# EAGLE design Board_1v2 (EAGLE 9.3.0)
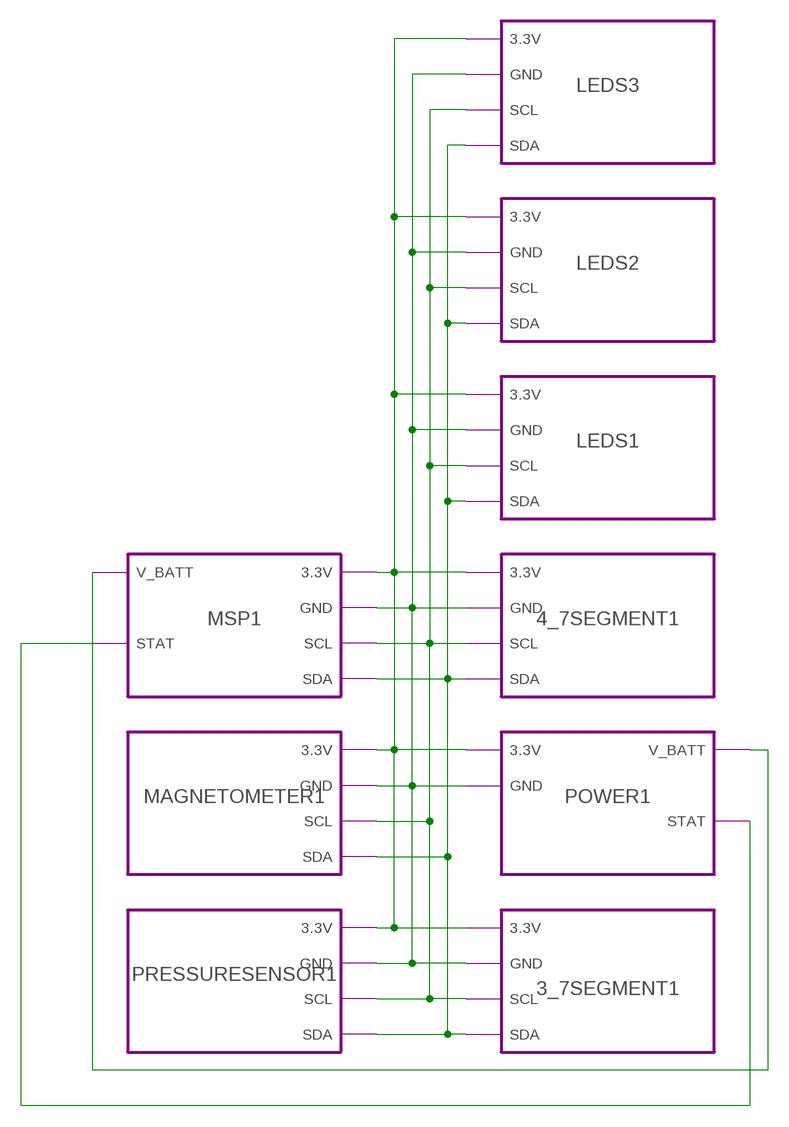
[diagram p0: schematic, sheet 1]

## Module instances
3_7SEGMENT1 = 3_7SEGMENT
4_7SEGMENT1 = 4_7SEGMENT
MAGNETOMETER1 = MAGNETOMETER
POWER1 = POWER
PRESSURESENSOR1 = PRESSURESENSOR
MSP1 = MSP
LEDS1 = LEDS
LEDS2 = LEDS
LEDS3 = LEDS

## Nets
3.3V: port MAGNETOMETER1.3.3V PRESSURESENSOR1.3.3V POWER1.3.3V MSP1.3.3V LEDS3.3.3V 3_7SEGMENT1.3.3V LEDS2.3.3V LEDS1.3.3V 4_7SEGMENT1.3.3V
GND: port MAGNETOMETER1.GND POWER1.GND PRESSURESENSOR1.GND 4_7SEGMENT1.GND 3_7SEGMENT1.GND MSP1.GND LEDS3.GND LEDS2.GND LEDS1.GND
N$1: port POWER1.V_BATT MSP1.V_BATT
N$2: port POWER1.STAT MSP1.STAT
SCL: port PRESSURESENSOR1.SCL 4_7SEGMENT1.SCL MAGNETOMETER1.SCL 3_7SEGMENT1.SCL MSP1.SCL LEDS3.SCL LEDS2.SCL LEDS1.SCL
SDA: port PRESSURESENSOR1.SDA 4_7SEGMENT1.SDA MAGNETOMETER1.SDA 3_7SEGMENT1.SDA MSP1.SDA LEDS3.SDA LEDS2.SDA LEDS1.SDA

## Library data of the parts

## Module MAGNETOMETER
Ports: 3.3V(io) GND(io) SCL(io) SDA(io)
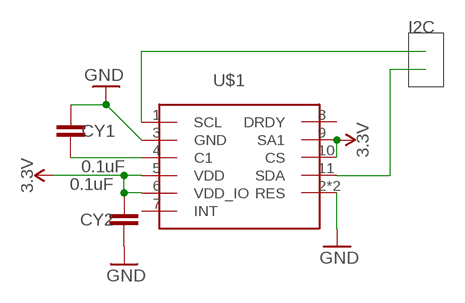
[diagram p1: schematic, module MAGNETOMETER, sheet 1]

### Parts
CY1  0.1uF  0.1UF-0603-25V-5%  [0603]
CY2  0.1uF  0.1UF-0603-25V-5%  [0603]
U$1  LIS3MDLTR  [LGA-12]

### Nets
3.3V: CY2.2 U$1.5(VDD) U$1.6(VDD_IO) U$1.9(SA1) U$1.10(CS)
GND: CY1.1 CY2.1 U$1.2(RES) U$1.3(GND) U$1.12(RES)
N$3: CY1.2 U$1.4(C1)
SCL: U$1.1(SCL)
SDA: U$1.11(SDA)
Unconnected: U$1.7(INT) U$1.8(DRDY)

### Notes on the sheet
- I2C

### Library data of the parts
CY1 CY2 = SparkFun-Capacitors:0.1UF: 0.1µF ceramic capacitors A capacitor is a passive two-terminal electrical component used to store electrical energy temporarily in an electric field.; PROD_ID: CAP-08604
U$1 = LED Driver:LIS3MDLTR

## Module POWER
Ports: GND(io) 3.3V(io) V_BATT(io) STAT(io)
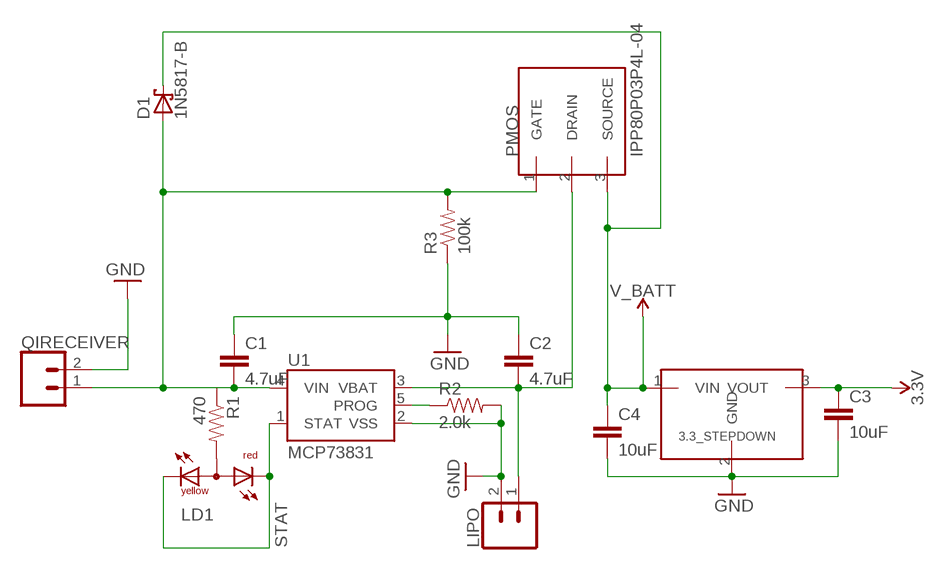
[diagram p2: schematic, module POWER, sheet 1]

### Parts
3.3_STEPDOWN  MCP1826S  [T03B]
C1  4.7uF  4.7UF0603  [0603]
C2  4.7uF  4.7UF0603  [0603]
C3  10uF  10UF-0603-6.3V-20%  [0603]
C4  10uF  10UF-0603-6.3V-20%  [0603]
D1  1N5817-B  [DO41-7.6]
LD1  DUOLED-RY-A  [DUOLED-A-5MM]
LIPO  CONN_02  [1X02]
PMOS  IPP80P03P4L-04  [T03B]
QIRECEIVER  CONN_02  [1X02]
R1  470  470OHM-0603-1/10W-1%  [0603]
R2  2.0k  2.0KOHM-0603-1/10W-5%  [0603]
R3  100k  100KOHM-0603-1/10W-1%  [0603]
U1  MCP73831  [SOT23-5]

### Nets
3.3V: 3.3_STEPDOWN.3(VOUT) C3.1
GND: 3.3_STEPDOWN.2(GND) C1.1 C2.1 C3.2 C4.2 LIPO.2 QIRECEIVER.2 R2.2 R3.1 U1.2(VSS)
N$2: C2.2 LIPO.1 PMOS.2(DRAIN) U1.3(VBAT)
N$4: C1.2 D1.A PMOS.1(GATE) QIRECEIVER.1 R1.1 R3.2 U1.4(VIN)
N$6: R2.1 U1.5(PROG)
N$7: LD1.A R1.2
STAT: LD1.CR LD1.CX(CY) U1.1(STAT)
V_BATT: 3.3_STEPDOWN.1(VIN) C4.1 D1.C PMOS.3(SOURCE)

### Library data of the parts
3.3_STEPDOWN = LED Driver:MCP1826S
C1 C2 = SparkFun-Capacitors:4.7UF: 4.7µF ceramic capacitors A capacitor is a passive two-terminal electrical component used to store electrical energy temporarily in an electric field.; PROD_ID: CAP-08280
C3 C4 = SparkFun-Capacitors:10UF: 10.0µF ceramic capacitors A capacitor is a passive two-terminal electrical component used to store electrical energy temporarily in an electric field.; PROD_ID: CAP-11015
D1 = diode:1N581*: 1.0A SCHOTTKY BARRIER RECTIFIER Source: http://www.diodes.com/datasheets/ds23001.pdf
LD1 = led:DUOLED-RY-A: DUO LED 2 colors (red/yellow), 5 mm, round, common Anode www.ligitek.com or other producers.
LIPO QIRECEIVER = SparkFun-Connectors:CONN_02: Multi connection point. Often used as Generic Header-pin footprint for 0.1 inch spaced/style header connections On any of the 0.1 inch spaced packages, you can populate with these: Break Away Headers - Straight <https://www.sparkfun.com/products/116> (PRT-00116) Break Away Male Headers - Right Angle <https://www.sparkfun.com/products/553> (PRT-00553) Female Headers <https://www.sparkfun.com/products/115> (PRT-00115) Break Away Headers - Machine Pin <https://www.sparkfun.com/products/117> (PRT-00117) Break Away Female Headers - Swiss Machine Pin <https://www.sparkfun.com/products/743> (PRT-00743) For SCREWTERMINALS and SPRING TERMINALS visit here: Screw Terimnals on SparkFun.com <https://www.sparkfun.com/search/results?term=Screw+Terminals> (5mm/3.5mm/2.54mm spacing) This device is also useful as a general connection point to wire up your design to another part of your project. Our various solder wires solder well into these plated through hole pads. Hook-Up Wire - Assortment (Stranded, 22 AWG) <https://www.sparkfun.com/products/11375> (PRT-11375) Hook-Up Wire - Assortment (Solid Core, 22 AWG) <https://www.sparkfun.com/products/11367> (PRT-11367) View the entire wire category on our website here <https://www.sparkfun.com/categories/141> Special notes: Molex polarized connector foot print use with: PRT-08233 with associated crimp pins and housings. 2.54_SCREWTERM for use with PRT-10571. 3.5mm Screw Terminal footprints for PRT-08084 5mm Screw Terminal footprints for use with PRT-08432
PMOS = LED Driver:IPP80P03P4L-04
R1 = SparkFun-Resistors:470OHM: 470Ω resistor A resistor is a passive two-terminal electrical component that implements electrical resistance as a circuit element. Resistors act to reduce current flow, and, at the same time, act to lower voltage levels within circuits. - Wikipedia; PROD_ID: RES-07869
R2 = SparkFun-Resistors:2.0KOHM: 2kΩ resistor A resistor is a passive two-terminal electrical component that implements electrical resistance as a circuit element. Resistors act to reduce current flow, and, at the same time, act to lower voltage levels within circuits. - Wikipedia; PROD_ID: RES-08296
R3 = SparkFun-Resistors:100KOHM: 100kΩ resistor A resistor is a passive two-terminal electrical component that implements electrical resistance as a circuit element. Resistors act to reduce current flow, and, at the same time, act to lower voltage levels within circuits. - Wikipedia; PROD_ID: RES-07828
U1 = SparkFun-IC-Power:MCP73831: MCP73831T Li-Ion, Li-Pol Controller Miniature single cell, fully integrated Li-Ion, Li-polymer charge management controller Datasheet <http://ww1.microchip.com/downloads/en/DeviceDoc/20001984g.pdf> SparkFun Products: SparkFun ESP32 Thing <https://www.sparkfun.com/products/13907> SparkFun 9DoF Razor IMU M0 <https://www.sparkfun.com/products/14001>; PROD_ID: IC-09995

## Module 4_7SEGMENT
Ports: GND(io) SCL(io) SDA(io) 3.3V(io)
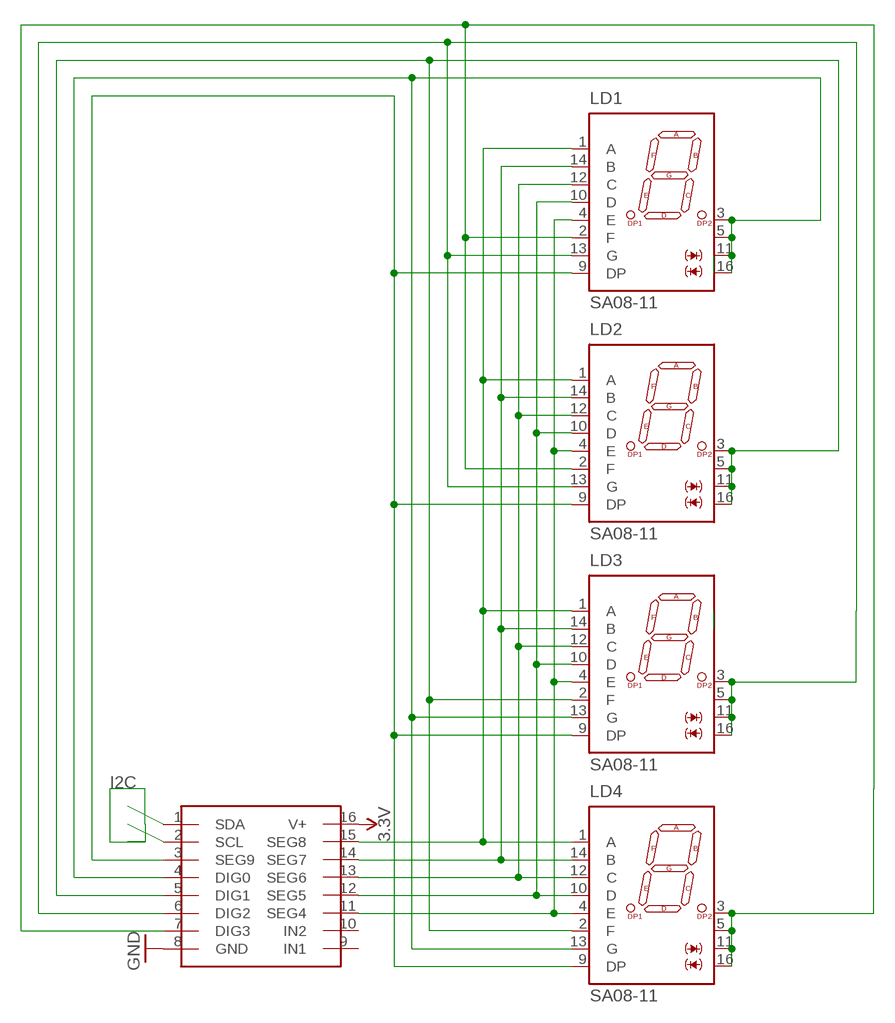
[diagram p3: schematic, module 4_7SEGMENT, sheet 1]

### Parts
LD1  SA08-11  [SA08]
LD2  SA08-11  [SA08]
LD3  SA08-11  [SA08]
LD4  SA08-11  [SA08]
LED_DRIVER_1  MAX6958BAPE+  [DIP16]

### Nets
3.3V: LED_DRIVER_1.16(V+)
GND: LED_DRIVER_1.8(GND)
N$1: LD1.1(A) LD2.1(A) LD3.1(A) LD4.1(A) LED_DRIVER_1.15(SEG8)
N$2: LD1.14(B) LD2.14(B) LD3.14(B) LD4.14(B) LED_DRIVER_1.14(SEG7)
N$3: LD1.12(C) LD2.12(C) LD3.12(C) LD4.12(C) LED_DRIVER_1.13(SEG6)
N$4: LD1.10(D) LD2.10(D) LD3.10(D) LD4.10(D) LED_DRIVER_1.12(SEG5)
N$5: LD1.4(E) LD2.4(E) LD3.4(E) LD4.4(E) LED_DRIVER_1.11(SEG4)
N$6: LD1.3(AK) LD1.5(AK) LD1.11(AK) LD1.16(AK) LD3.13(G) LD4.13(G) LED_DRIVER_1.4(DIG0)
N$7: LD1.9(DP) LD2.9(DP) LD3.9(DP) LD4.9(DP) LED_DRIVER_1.3(SEG9)
N$9: LD1.2(F) LD2.2(F) LD4.3(AK) LD4.5(AK) LD4.11(AK) LD4.16(AK) LED_DRIVER_1.7(DIG3)
N$12: LD2.3(AK) LD2.5(AK) LD2.11(AK) LD2.16(AK) LD3.2(F) LD4.2(F) LED_DRIVER_1.5(DIG1)
N$13: LD1.13(G) LD2.13(G) LD3.3(AK) LD3.5(AK) LD3.11(AK) LD3.16(AK) LED_DRIVER_1.6(DIG2)
SCL: LED_DRIVER_1.2(SCL)
SDA: LED_DRIVER_1.1(SDA)
Unconnected: LED_DRIVER_1.9(IN1) LED_DRIVER_1.10(IN2)

### Library data of the parts
LD1-LD4 = led:S*08: Kingbright 20mm (0.8Inch) Single Digit Numeric Display Source: SA08-11SRWA.pdf
LED_DRIVER_1 = UnderwaterSensorProject2:MAX6958BAPE+

## Module 3_7SEGMENT
Ports: GND(io) SCL(io) SDA(io) 3.3V(io)
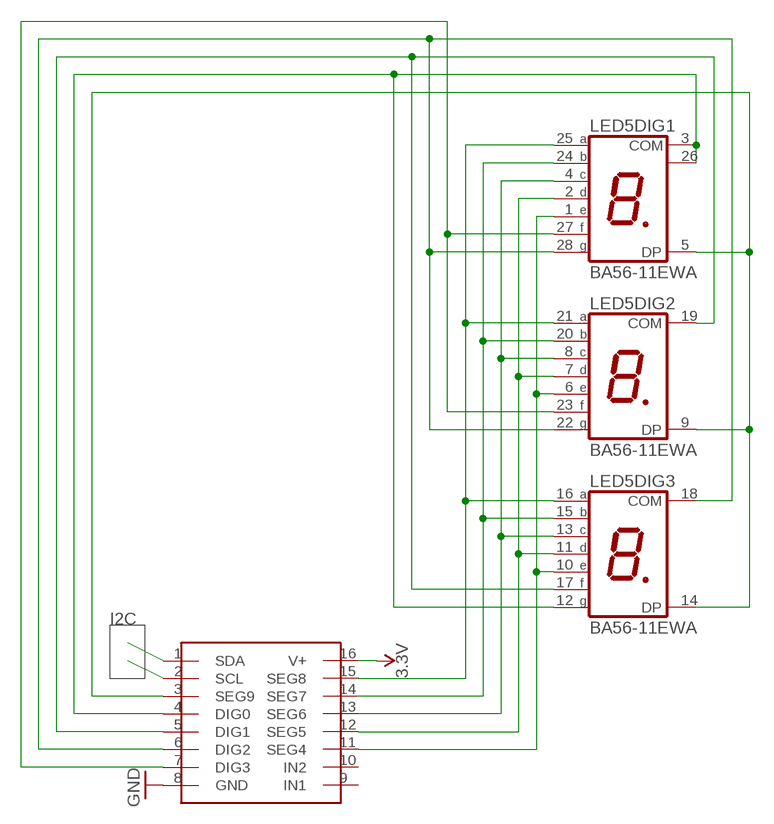
[diagram p4: schematic, module 3_7SEGMENT, sheet 1]

### Parts
LED5  BA56-11EWA  [BA/BC56]
U$1  MAX6958BAPE+  [DIP16]

### Nets
3.3V: U$1.16(V+)
GND: U$1.8(GND)
N$1: LED5.3(DIG1:COM) LED5.12(DIG3:G) LED5.26(DIG1:COM) U$1.4(DIG0)
N$2: LED5.5(DIG1:DP) LED5.9(DIG2:DP) LED5.14(DIG3:DP) U$1.3(SEG9)
N$8: LED5.16(DIG3:A) LED5.21(DIG2:A) LED5.25(DIG1:A) U$1.15(SEG8)
N$9: LED5.15(DIG3:B) LED5.20(DIG2:B) LED5.24(DIG1:B) U$1.14(SEG7)
N$10: LED5.4(DIG1:C) LED5.8(DIG2:C) LED5.13(DIG3:C) U$1.13(SEG6)
N$11: LED5.2(DIG1:D) LED5.7(DIG2:D) LED5.11(DIG3:D) U$1.12(SEG5)
N$26: LED5.1(DIG1:E) LED5.6(DIG2:E) LED5.10(DIG3:E) U$1.11(SEG4)
N$28: LED5.17(DIG3:F) LED5.19(DIG2:COM) U$1.5(DIG1)
N$29: LED5.23(DIG2:F) LED5.27(DIG1:F) U$1.7(DIG3)
N$30: LED5.18(DIG3:COM) LED5.22(DIG2:G) LED5.28(DIG1:G) U$1.6(DIG2)
SCL: U$1.2(SCL)
SDA: U$1.1(SDA)
Unconnected: U$1.9(IN1) U$1.10(IN2)

### Notes on the sheet
- I2C

### Library data of the parts
LED5 = display-kingbright:B?56-11*WA: 14.22mm (0.56INCH) THREE DIGIT NUMERIC DISPLAY Source: http://www.kingbright.com .. BA56-11EWA(Ver1189474895.pdf; OC_FARNELL: unknown; OC_NEWARK: unknown
U$1 = LED Driver:MAX6958BAPE+

## Module PRESSURESENSOR
Ports: 3.3V(io) GND(io) SCL(io) SDA(io)
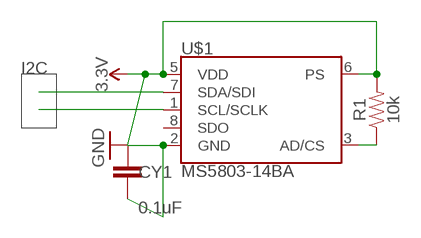
[diagram p5: schematic, module PRESSURESENSOR, sheet 1]

### Parts
CY1  0.1uF  0.1UF-0603-25V-5%  [0603]
R1  10k  10KOHM-0603-1/10W-1%  [0603]
U$1  MS5803-14BA  [DIL8]

### Nets
3.3V: CY1.1 R1.2 U$1.5(VDD) U$1.6(PS)
GND: CY1.2 U$1.2(GND)
N$1: R1.1 U$1.3(AD/CS)
SCL: U$1.1(SCL/SCLK)
SDA: U$1.7(SDA/SDI)
Unconnected: U$1.8(SDO)

### Notes on the sheet
- I2C

### Library data of the parts
CY1 = SparkFun-Capacitors:0.1UF: 0.1µF ceramic capacitors A capacitor is a passive two-terminal electrical component used to store electrical energy temporarily in an electric field.; PROD_ID: CAP-08604
R1 = SparkFun-Resistors:10KOHM: 10kΩ resistor A resistor is a passive two-terminal electrical component that implements electrical resistance as a circuit element. Resistors act to reduce current flow, and, at the same time, act to lower voltage levels within circuits. - Wikipedia; PROD_ID: RES-00824
U$1 = UnderwaterSensorProject:MS5803-14BA

## Module MSP
Ports: SDA(io) SCL(io) GND(io) 3.3V(io) V_BATT(io) STAT(io)
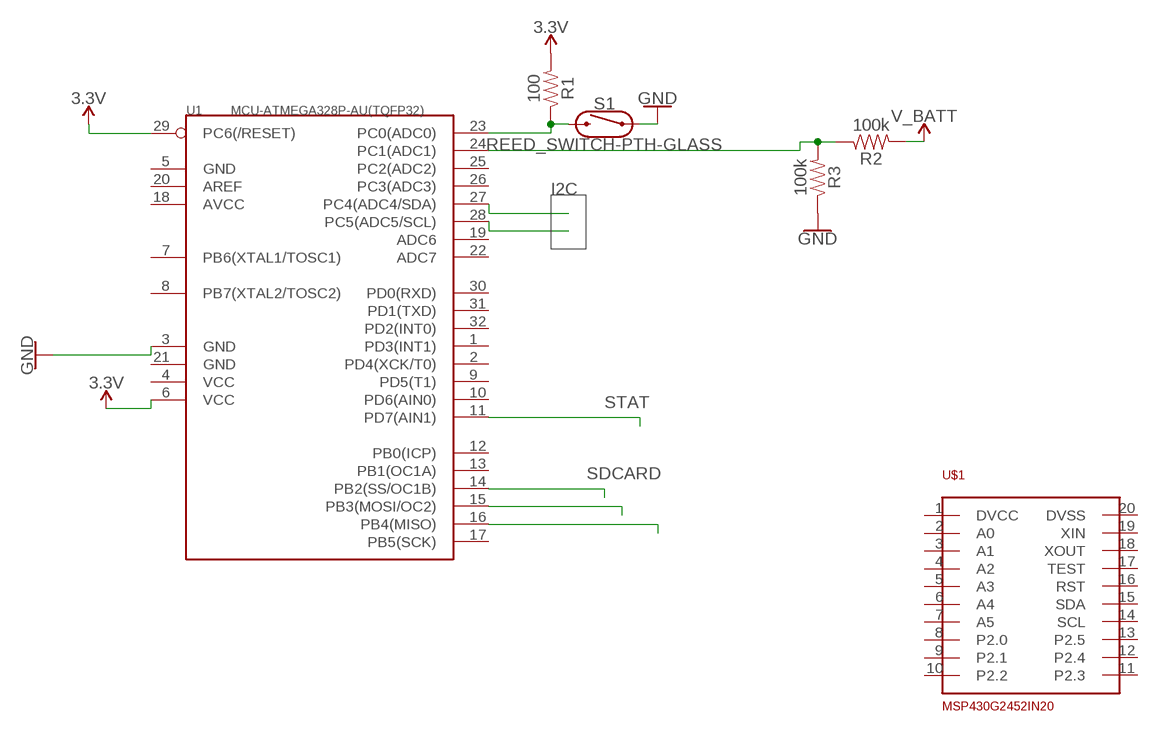
[diagram p6: schematic, module MSP, sheet 1]

### Parts
R1  100  100OHM-0603-1/4W-5%  [0603]
R2  100k  100KOHM-0603-1/10W-1%  [0603]
R3  100k  100KOHM-0603-1/10W-1%  [0603]
S1  REED_SWITCH-PTH-GLASS  [REED_SWITCH_GLASS]
U1  MCU-ATMEGA328P-AU(TQFP32)  [TQFP32-0.8-7X7MM]
U$1  MSP430G2452IN20  [DIL20]

### Nets
3.3V: R1.2 U1.6(VCC) U1.29(PC6(/RESET))
GND: R3.1 S1.P$1 U1.3(GND)
N$1: R1.1 S1.P$2 U1.23(PC0(ADC0))
N$2: R2.1 R3.2 U1.24(PC1(ADC1))
N$4: U1.15(PB3(MOSI/OC2))
N$5: U1.16(PB4(MISO))
SCL: U1.28(PC5(ADC5/SCL))
SDA: U1.27(PC4(ADC4/SDA))
SDCARD: U1.14(PB2(SS/OC1B))
STAT: U1.11(PD7(AIN1))
V_BATT: R2.2
Unconnected: U1.1(PD3(INT1)) U1.2(PD4(XCK/T0)) U1.4(VCC) U1.5(GND) U1.7(PB6(XTAL1/TOSC1)) U1.8(PB7(XTAL2/TOSC2)) U1.9(PD5(T1)) U1.10(PD6(AIN0)) U1.12(PB0(ICP)) U1.13(PB1(OC1A)) U1.17(PB5(SCK)) U1.18(AVCC) U1.19(ADC6) U1.20(AREF) U1.21(GND) U1.22(ADC7) U1.25(PC2(ADC2)) U1.26(PC3(ADC3)) U1.30(PD0(RXD)) U1.31(PD1(TXD)) U1.32(PD2(INT0)) U$1.1(DVCC) U$1.2(A0) U$1.3(A1) U$1.4(A2) U$1.5(A3) U$1.6(A4) U$1.7(A5) U$1.8(P2.0) U$1.9(P2.1) U$1.10(P2.2) U$1.11(P2.3) U$1.12(P2.4) U$1.13(P2.5) U$1.14(SCL) U$1.15(SDA) U$1.16(RST) U$1.17(TEST) U$1.18(XOUT) U$1.19(XIN) U$1.20(DVSS)

### Notes on the sheet
- I2C

### Library data of the parts
R1 = SparkFun-Resistors:100OHM: 100Ω resistor A resistor is a passive two-terminal electrical component that implements electrical resistance as a circuit element. Resistors act to reduce current flow, and, at the same time, act to lower voltage levels within circuits. - Wikipedia; PROD_ID: RES-12438
R2 R3 = SparkFun-Resistors:100KOHM: 100kΩ resistor A resistor is a passive two-terminal electrical component that implements electrical resistance as a circuit element. Resistors act to reduce current flow, and, at the same time, act to lower voltage levels within circuits. - Wikipedia; PROD_ID: RES-07828
S1 = SparkFun-Switches:REED_SWITCH: Reed Switch A reed switch is a magnetically-actuated switch. When the device is exposed to a magnetic field, the two ferrous materials inside the switch pull together and the switch closes. Variant Overview PTH-GLASS Reed Switch <https://www.sparkfun.com/products/8642> (COM-08642) - PTH reed switch w/ glass body (6.0 x 0.9 mm) PTH-INSULATED Reed Switch - Insulated <https://www.sparkfun.com/products/10601> (COM-10601) - PTH reed switch w/ insulated body (15.1 x 4.2 mm); PROD_ID: SWCH-09282; SF_SKU: COM-08642
U1 = MCU-ATMEGA328P-AU_TQFP32_:MCU-ATMEGA328P-AU(TQFP32): 310010049; AVAILABILITY: Unavailable; DESCRIPTION: Microcontroller Mcu, 8 Bit, Atmega, 20mhz, Tqfp-32; MF: Microchip; MP: ATMEGA328P-AU; PACKAGE: TQFP-32 Microchip; PRICE: None
U$1 = UnderwaterSensorProject:MSP430G2452IN20

## Module LEDS
Ports: SDA(io) SCL(io) GND(io) 3.3V(io)
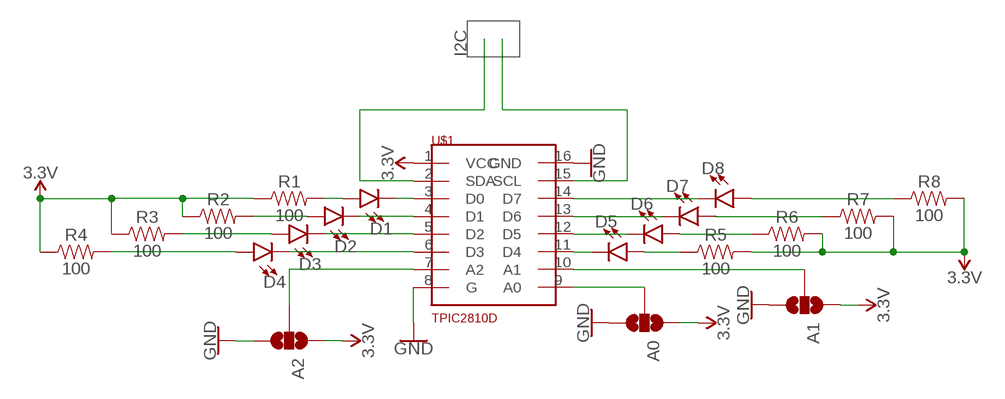
[diagram p7: schematic, module LEDS, sheet 1]

### Parts
A0  JUMPER-SMT_3_NO_SILK  [SMT-JUMPER_3_NO_SILK]
A1  JUMPER-SMT_3_NO_SILK  [SMT-JUMPER_3_NO_SILK]
A2  JUMPER-SMT_3_NO_SILK  [SMT-JUMPER_3_NO_SILK]
D1  LED5MM  [LED_5MM]
D2  LED5MM  [LED_5MM]
D3  LED5MM  [LED_5MM]
D4  LED5MM  [LED_5MM]
D5  LED5MM  [LED_5MM]
D6  LED5MM  [LED_5MM]
D7  LED5MM  [LED_5MM]
D8  LED5MM  [LED_5MM]
R1  100  100OHM-0603-1/4W-5%  [0603]
R2  100  100OHM-0603-1/4W-5%  [0603]
R3  100  100OHM-0603-1/4W-5%  [0603]
R4  100  100OHM-0603-1/4W-5%  [0603]
R5  100  100OHM-0603-1/4W-5%  [0603]
R6  100  100OHM-0603-1/4W-5%  [0603]
R7  100  100OHM-0603-1/4W-5%  [0603]
R8  100  100OHM-0603-1/4W-5%  [0603]
U$1  TPIC2810D  [SO16]

### Nets
3.3V: A0.1 A1.1 A2.1 R1.1 R2.1 R3.1 R4.1 R5.2 R6.2 R7.2 R8.2 U$1.1(VCC)
GND: A0.3 A1.3 A2.3 U$1.8(G) U$1.16(GND)
N$1: D1.K(C) U$1.3(D0)
N$2: D2.K(C) U$1.4(D1)
N$3: D3.K(C) U$1.5(D2)
N$4: D4.K(C) U$1.6(D3)
N$5: D5.K(C) U$1.11(D4)
N$6: D6.K(C) U$1.12(D5)
N$7: D7.K(C) U$1.13(D6)
N$8: D8.K(C) U$1.14(D7)
N$9: A2.2 U$1.7(A2)
N$10: A1.2 U$1.10(A1)
N$11: A0.2 U$1.9(A0)
N$12: D5.A R5.1
N$13: D6.A R6.1
N$14: D7.A R7.1
N$15: D8.A R8.1
N$16: D1.A R1.2
N$18: D2.A R2.2
N$19: D3.A R3.2
N$20: D4.A R4.2
SCL: U$1.15(SCL)
SDA: U$1.2(SDA)

### Notes on the sheet
- I2C

### Library data of the parts
A0 A1 A2 = SparkFun-Jumpers:JUMPER-SMT_3_NO: Normally open jumper This jumper has three pads in close proximity to each other. Apply solder to close the connection(s).
D1-D8 = SparkFun-LED:LED: LED (Generic) Standard schematic elements and footprints for 5mm, 3mm, 1206, and 0603 sized LEDs. Generic LEDs with no color specified.
R1-R8 = SparkFun-Resistors:100OHM: 100Ω resistor A resistor is a passive two-terminal electrical component that implements electrical resistance as a circuit element. Resistors act to reduce current flow, and, at the same time, act to lower voltage levels within circuits. - Wikipedia; PROD_ID: RES-12438
U$1 = UnderwaterSensorProject:TPIC2810D

## Board
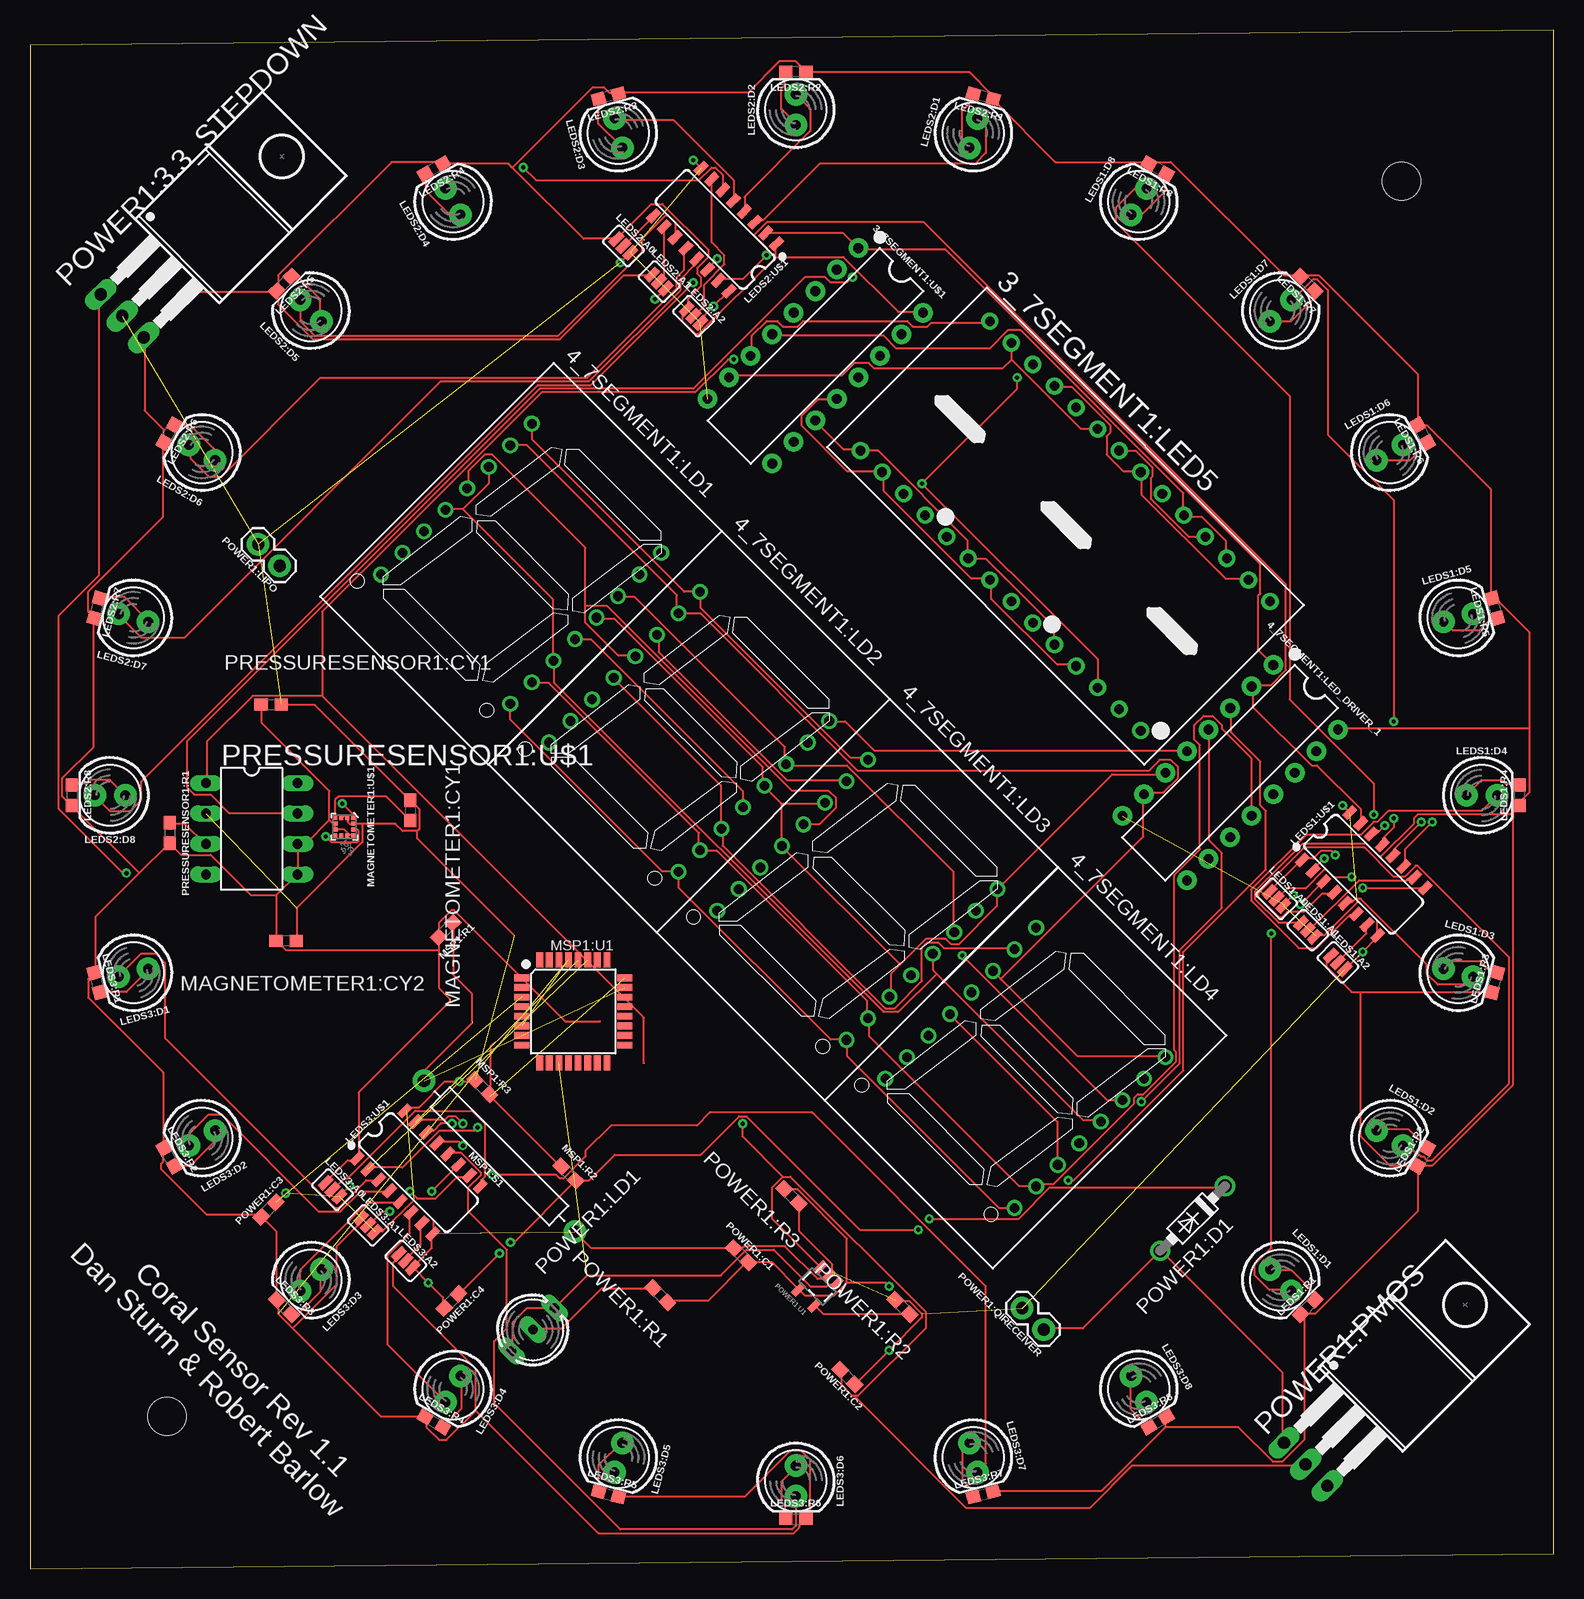
[diagram p8: board, top side]
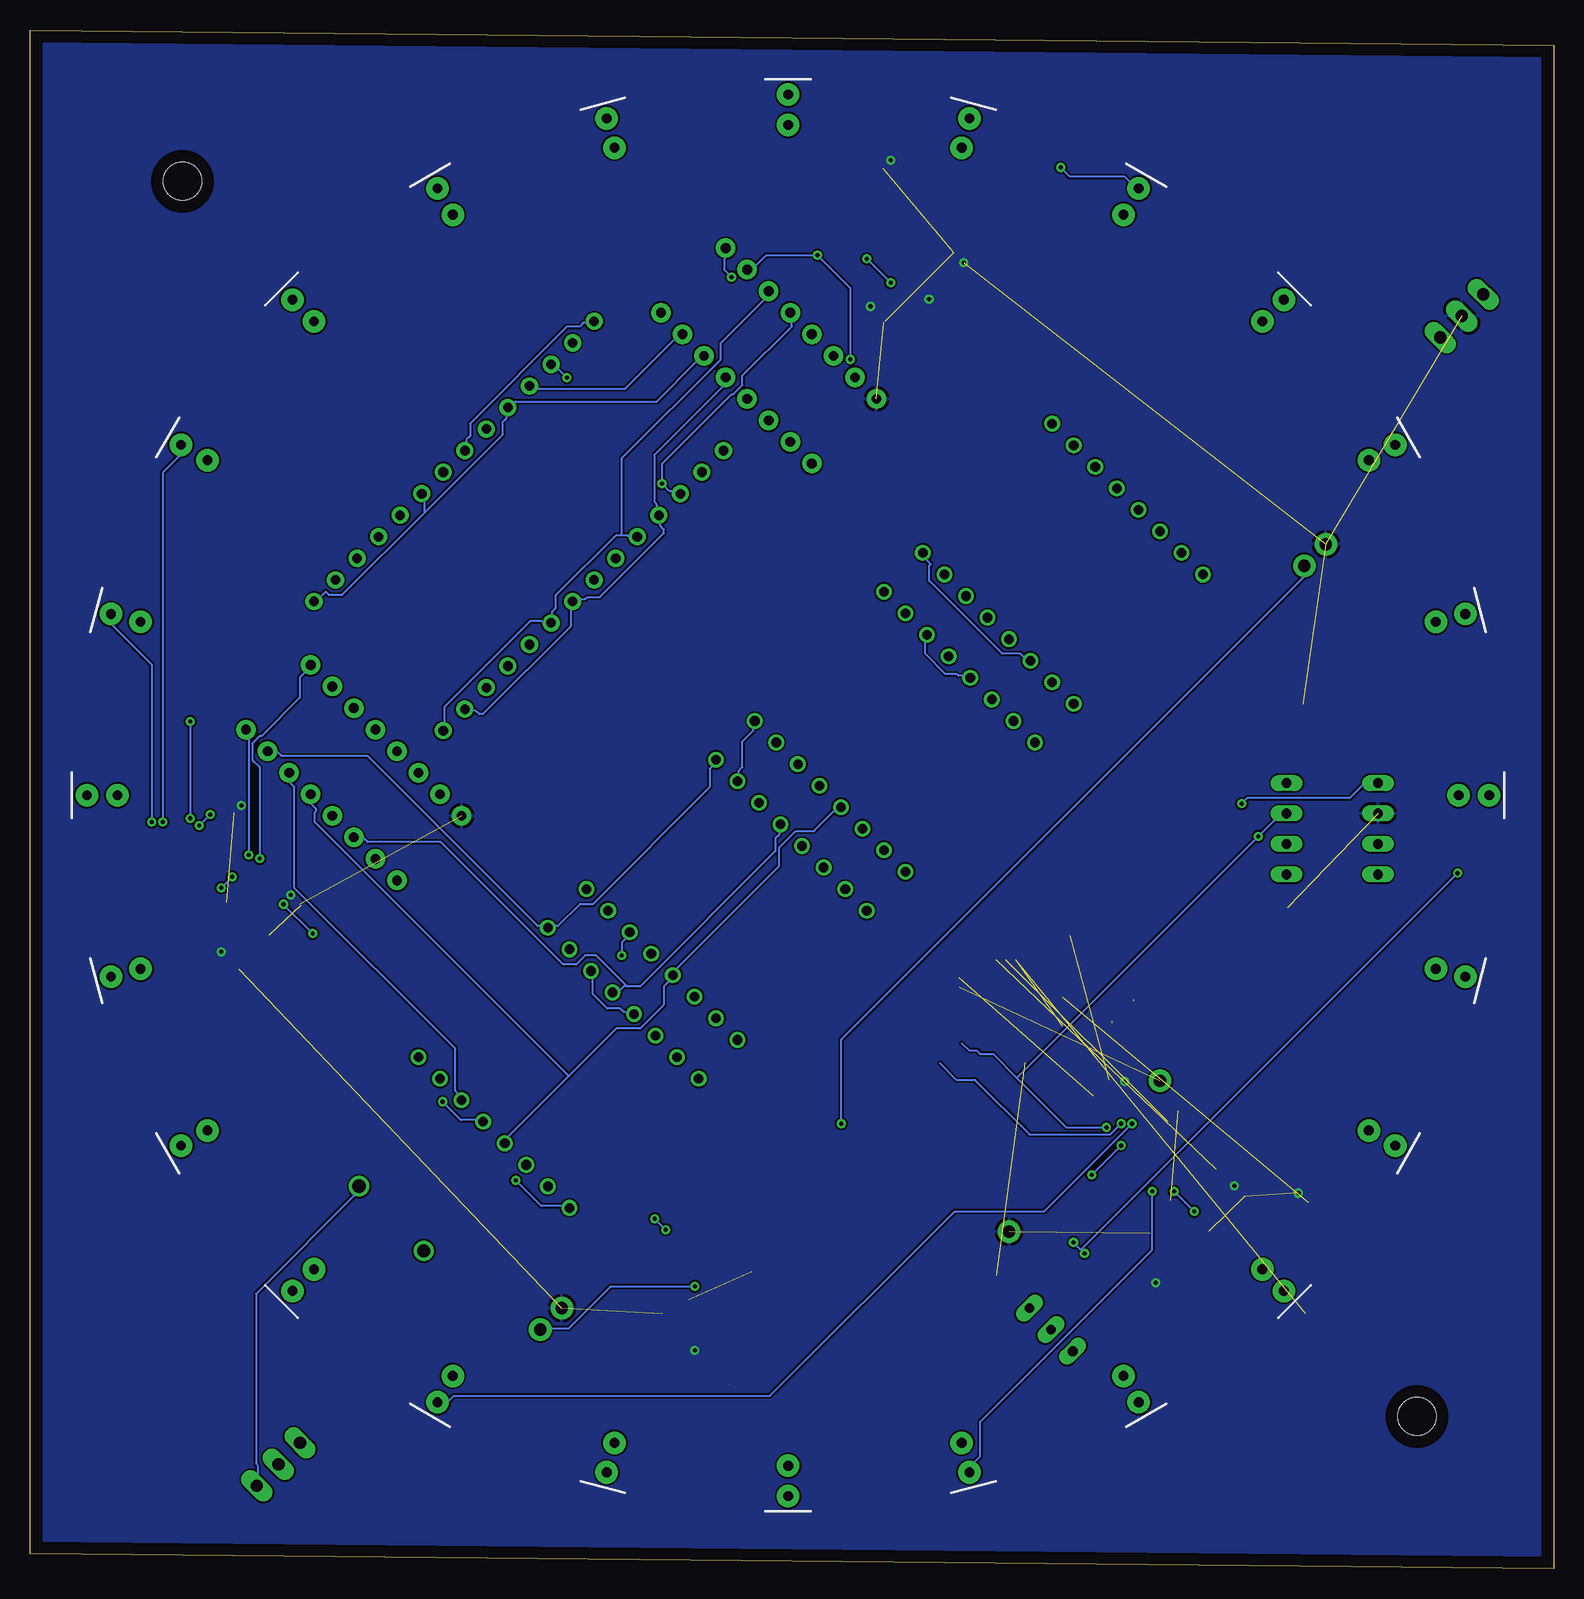
[diagram p9: board, bottom side, seen from below]

Size 127 x 128.27 mm. Coordinates in mm from the lower left corner, seen from the top.
Outline: 0,0 127,1.27 127,128.27 0,127 0,0
Copper layers (1*16): Top 0.035mm / dielectric 1.5mm / Bottom 0.035mm
Design rules "default *": minimum track width 6mil, minimum drill 0.35mm, track to track 6mil, track to pad 6mil, pad to pad 5mil, via to via 6mil, smd to smd 6mil, copper to edge 40mil, drill to drill 6mil, minimum pad ring 10mil, minimum via ring 8mil, stop-mask expansion 4mil, vias tented up to drill 20mil, thermal gap 10mil
Holes 3.17 mm at 114.29,115.66 11.42,12.7

### Footprints (pad centres in the part's own frame; a part is rotated, then mirrored left to right if it is on the bottom)
BA/BC56 = drill 0.8 pad 1.422: 1 -16.51,-7.62; 2 -13.97,-7.62; 3 -11.43,-7.62; 4 -8.89,-7.62; 5 -6.35,-7.62; 6 -3.81,-7.62; 7 -1.27,-7.62; 8 1.27,-7.62; 9 3.81,-7.62; 10 6.35,-7.62; 11 8.89,-7.62; 12 11.43,-7.62; 13 13.97,-7.62; 14 16.51,-7.62; 15 16.51,7.62; 16 13.97,7.62; 17 11.43,7.62; 18 8.89,7.62; 19 6.35,7.62; 20 3.81,7.62; 21 1.27,7.62; 22 -1.27,7.62; 23 -3.81,7.62; 24 -6.35,7.62; 25 -8.89,7.62; 26 -11.43,7.62; 27 -13.97,7.62; 28 -16.51,7.62
DIP16 = drill 0.813 pad 1.626: 1 -8.89,-3.81; 2 -6.35,-3.81; 3 -3.81,-3.81; 4 -1.27,-3.81; 5 1.27,-3.81; 6 3.81,-3.81; 7 6.35,-3.81; 8 8.89,-3.81; 9 8.89,3.81; 10 6.35,3.81; 11 3.81,3.81; 12 1.27,3.81; 13 -1.27,3.81; 14 -3.81,3.81; 15 -6.35,3.81; 16 -8.89,3.81
SA08 = drill 0.8 pad 1.27: 1 -7.62,8.89; 2 -7.62,6.35; 3 -7.62,3.81; 4 -7.62,1.27; 5 -7.62,-1.27; 6 -7.62,-3.81; 7 -7.62,-6.35; 8 -7.62,-8.89; 9 7.62,-8.89; 10 7.62,-6.35; 11 7.62,-3.81; 12 7.62,-1.27; 13 7.62,1.27; 14 7.62,3.81; 15 7.62,6.35; 16 7.62,8.89
SMT-JUMPER_3_NO_SILK = smd 0.635 x 1.27: 1 -0.813,0; 2 0,0; 3 0.813,0
LED_5MM = drill 0.813 pad 1.88: A -1.27,0; K 1.27,0
0603 = smd 1.1 x 1: 1 -0.85,0; 2 0.85,0
SO16 = smd 0.6 x 1.2: 1 -4.445,-2.8; 2 -3.175,-2.8; 3 -1.905,-2.8; 4 -0.635,-2.8; 5 0.635,-2.8; 6 1.905,-2.8; 7 3.175,-2.8; 8 4.445,-2.8; 9 4.445,2.8; 10 3.175,2.8; 11 1.905,2.8; 12 0.635,2.8; 13 -0.635,2.8; 14 -1.905,2.8; 15 -3.175,2.8; 16 -4.445,2.8
LGA-12 = smd 0.375 x 0.35: 1 -0.75,0.75; 2 -0.75,0.25; 3 -0.75,-0.25; 4 -0.75,-0.75; 7 0.75,-0.75; 8 0.75,-0.25; 9 0.75,0.25; 10 0.75,0.75 | smd 0.35 x 0.375: 5 -0.25,-0.75; 6 0.25,-0.75; 11 0.25,0.75; 12 -0.25,0.75
REED_SWITCH_GLASS = drill 1.016 pad 1.88: P$1 -8.89,0; P$2 8.89,0
TQFP32-0.8-7X7MM = smd 1.27 x 0.559: 1 -4.293,2.8; 2 -4.293,2; 3 -4.293,1.2; 4 -4.293,0.4; 5 -4.293,-0.4; 6 -4.293,-1.2; 7 -4.293,-2; 8 -4.293,-2.8; 17 4.293,-2.8; 18 4.293,-2; 19 4.293,-1.2; 20 4.293,-0.4; 21 4.293,0.4; 22 4.293,1.2; 23 4.293,2; 24 4.293,2.8 | smd 0.559 x 1.27: 9 -2.8,-4.293; 10 -2,-4.293; 11 -1.2,-4.293; 12 -0.4,-4.293; 13 0.4,-4.293; 14 1.2,-4.293; 15 2,-4.293; 16 2.8,-4.293; 25 2.8,4.293; 26 2,4.293; 27 1.2,4.293; 28 0.4,4.293; 29 -0.4,4.293; 30 -1.2,4.293; 31 -2,4.293; 32 -2.8,4.293
DIL20 = drill 0.813 long: 1 -11.43,-3.81; 2 -8.89,-3.81; 3 -6.35,-3.81; 4 -3.81,-3.81; 5 -1.27,-3.81; 6 1.27,-3.81; 7 3.81,-3.81; 8 6.35,-3.81; 9 8.89,-3.81; 10 11.43,-3.81; 11 11.43,3.81; 12 8.89,3.81; 13 6.35,3.81; 14 3.81,3.81; 15 1.27,3.81; 16 -1.27,3.81; 17 -3.81,3.81; 18 -6.35,3.81; 19 -8.89,3.81; 20 -11.43,3.81
T03B = drill 1.016 long: 1 -2.54,-11.43; 2 0,-11.43; 3 2.54,-11.43
DO41-7.6 = drill 1.1 pad 1.7: A 3.81,0; C -3.81,0
DUOLED-A-5MM = drill 0.813 long: A 0,0; CR 2.54,0; CX -2.54,0
1X02 = drill 1.016 pad 1.88: 1 0,0; 2 2.54,0
SOT23-5 = smd 0.55 x 1.2: 1 -0.95,-1.3; 2 0,-1.3; 3 0.95,-1.3; 4 0.95,1.3; 5 -0.95,1.3
DIL8 = drill 0.813 long: 1 -3.81,-3.81; 2 -1.27,-3.81; 3 1.27,-3.81; 4 3.81,-3.81; 5 3.81,3.81; 6 1.27,3.81; 7 -1.27,3.81; 8 -3.81,3.81

### Placement (x,y rotation side)
3_7SEGMENT1:LED5  BA56-11EWA  [BA/BC56]  86.27,86.92 315 top
3_7SEGMENT1:U$1  MAX6958BAPE+  [DIP16]  65.44,101.11 225 top
4_7SEGMENT1:LD1  SA08-11  [SA08]  40.92,83.78 315 top
4_7SEGMENT1:LD2  SA08-11  [SA08]  54.93,69.77 315 top
4_7SEGMENT1:LD3  SA08-11  [SA08]  68.94,55.76 315 top
4_7SEGMENT1:LD4  SA08-11  [SA08]  82.95,41.75 315 top
4_7SEGMENT1:LED_DRIVER_1  [DIP16]  100.01,66.36 225 top
LEDS1:A0  [SMT-JUMPER_3_NO_SILK]  103.87,55.85 315 top
LEDS1:A1  [SMT-JUMPER_3_NO_SILK]  106.48,53.25 315 top
LEDS1:A2  [SMT-JUMPER_3_NO_SILK]  108.99,50.55 315 top
LEDS1:D1  [LED_5MM]  104.23,24.06 315 top
LEDS1:D2  [LED_5MM]  113.32,35.9 330 top
LEDS1:D3  [LED_5MM]  119.02,49.68 345 top
LEDS1:D4  [LED_5MM]  120.97,64.47 0 top
LEDS1:D5  [LED_5MM]  119.02,79.26 15 top
LEDS1:D6  [LED_5MM]  113.32,93.05 30 top
LEDS1:D7  [LED_5MM]  104.23,104.88 45 top
LEDS1:D8  [LED_5MM]  92.4,113.96 60 top
LEDS1:R1  100  [0603]  106.48,21.82 45 top
LEDS1:R2  100  [0603]  116.07,34.31 60 top
LEDS1:R3  100  [0603]  122.09,48.86 75 top
LEDS1:R4  100  [0603]  124.15,64.47 90 top
LEDS1:R5  100  [0603]  122.09,80.08 105 top
LEDS1:R6  100  [0603]  116.07,94.63 120 top
LEDS1:R7  100  [0603]  106.48,107.13 135 top
LEDS1:R8  100  [0603]  93.98,116.71 150 top
LEDS1:U$1  TPIC2810D  [SO16]  111.15,57.92 315 top
LEDS2:A0  [SMT-JUMPER_3_NO_SILK]  49.45,110.27 315 top
LEDS2:A1  [SMT-JUMPER_3_NO_SILK]  52.42,107.31 315 top
LEDS2:A2  [SMT-JUMPER_3_NO_SILK]  55.29,104.43 315 top
LEDS2:D1  [LED_5MM]  78.61,119.67 75 top
LEDS2:D2  [LED_5MM]  63.82,121.62 90 top
LEDS2:D3  [LED_5MM]  49.03,119.67 105 top
LEDS2:D4  [LED_5MM]  35.25,113.96 120 top
LEDS2:D5  [LED_5MM]  23.41,104.88 135 top
LEDS2:D6  [LED_5MM]  14.33,93.05 150 top
LEDS2:D7  [LED_5MM]  8.62,79.26 165 top
LEDS2:D8  [LED_5MM]  6.67,64.47 180 top
LEDS2:R1  100  [0603]  79.44,122.74 165 top
LEDS2:R2  100  [0603]  63.82,124.8 180 top
LEDS2:R3  100  [0603]  48.21,122.74 195 top
LEDS2:R4  100  [0603]  33.66,116.71 210 top
LEDS2:R5  100  [0603]  21.17,107.13 225 top
LEDS2:R6  100  [0603]  11.58,94.63 240 top
LEDS2:R7  100  [0603]  5.55,80.08 255 top
LEDS2:R8  100  [0603]  3.5,64.47 270 top
LEDS2:U$1  TPIC2810D  [SO16]  57.09,111.62 135 top
LEDS3:A0  [SMT-JUMPER_3_NO_SILK]  25.21,31.6 315 top
LEDS3:A1  [SMT-JUMPER_3_NO_SILK]  28.17,28.64 315 top
LEDS3:A2  [SMT-JUMPER_3_NO_SILK]  31.31,25.68 315 top
LEDS3:D1  [LED_5MM]  8.62,49.68 195 top
LEDS3:D2  [LED_5MM]  14.33,35.9 210 top
LEDS3:D3  [LED_5MM]  23.41,24.06 225 top
LEDS3:D4  [LED_5MM]  35.25,14.98 240 top
LEDS3:D5  [LED_5MM]  49.03,9.27 255 top
LEDS3:D6  [LED_5MM]  63.82,7.32 270 top
LEDS3:D7  [LED_5MM]  78.61,9.27 285 top
LEDS3:D8  [LED_5MM]  92.4,14.98 300 top
LEDS3:R1  100  [0603]  5.55,48.86 285 top
LEDS3:R2  100  [0603]  11.58,34.31 300 top
LEDS3:R3  100  [0603]  21.17,21.82 315 top
LEDS3:R4  100  [0603]  33.66,12.23 330 top
LEDS3:R5  100  [0603]  48.21,6.2 345 top
LEDS3:R6  100  [0603]  63.82,4.15 0 top
LEDS3:R7  100  [0603]  79.44,6.2 15 top
LEDS3:R8  100  [0603]  93.98,12.23 30 top
LEDS3:U$1  TPIC2810D  [SO16]  32.39,33.04 315 top
MAGNETOMETER1:CY1  0.1uF  [0603]  31.67,63.21 270 top
MAGNETOMETER1:CY2  0.1uF  [0603]  21.35,52.35 180 top
MAGNETOMETER1:U$1  [LGA-12]  26.2,61.87 270 top
MSP1:R1  100  [0603]  34.64,53.25 225 top
MSP1:R2  100k  [0603]  44.87,32.95 315 top
MSP1:R3  100k  [0603]  37.69,40.13 315 top
MSP1:S1  REED_SWITCH-PTH-GLASS  [REED_SWITCH_GLASS]  39.13,34.39 135 top
MSP1:U1  MCU-ATMEGA328P-AU(TQFP32)  [TQFP32-0.8-7X7MM]  45.27,46.45 0 top
MSP1:U$1  MSP430G2452IN20  [DIL20]  -20.18,35.67 315 top  (outside the outline)
POWER1:3.3_STEPDOWN  MCP1826S  [T03B]  15.78,112.52 315 top
POWER1:C1  4.7uF  [0603]  59.24,26.13 315 top
POWER1:C2  4.7uF  [0603]  68.13,15.97 135 top
POWER1:C3  10uF  [0603]  19.87,29.94 45 top
POWER1:C4  10uF  [0603]  35.11,22.32 225 top
POWER1:D1  1N5817-B  [DO41-7.6]  96.88,29.19 225 top
POWER1:LD1  [DUOLED-A-5MM]  41.91,19.93 45 top
POWER1:LIPO  [1X02]  20.81,83.6 135 top
POWER1:PMOS  IPP80P03P4L-04  [T03B]  114.38,16.79 315 top
POWER1:QIRECEIVER  [1X02]  84.48,19.93 135 top
POWER1:R1  470  [0603]  52.52,22.82 135 top
POWER1:R2  2.0k  [0603]  72.71,21.82 135 top
POWER1:R3  100k  [0603]  63.46,31.06 135 top
POWER1:U1  MCP73831  [SOT23-5]  65.62,23.52 135 top
PRESSURESENSOR1:CY1  0.1uF  [0603]  20.1,72.03 0 top
PRESSURESENSOR1:R1  10k  [0603]  11.65,61.33 270 top
PRESSURESENSOR1:U$1  MS5803-14BA  [DIL8]  18.47,61.69 270 top

### Tracks (layer width: path | path; a pad name or v marks a point on that pad's centre or on a via)
3.3V  (via drill 0.35)  (3 unrouted)
  Top 0.152: LEDS3:R5.2 49.03,6.02 59.55,6.02 63.36,9.83 64.27,9.83 65.03,9.06 65.03,4.49 64.73,4.19 LEDS3:R6.2 64.58,4.03 64.12,3.58 64.12,3.42 63.66,2.97 47.36,2.97 37.15,13.18 | 21.91,20.04 20.69,21.26 20.69,22.32 LEDS3:R3.1 20.53,22.47 20.53,28.11 19.31,29.33 POWER1:C3.1 19.16,29.49 14.74,29.49 10.93,33.3 10.93,33.75 11.09,33.9 11.09,34.97 LEDS3:R2.1 11.09,35.12 11.09,41.37 4.84,47.62 4.84,49.14 5.29,49.6 LEDS3:R1.1 5.45,49.75 5.45,54.33 9.1,57.98 | 21.91,20.04 29.22,12.72 32.88,12.72 LEDS3:R4.1 33.03,12.57 33.03,11.81 34.1,10.74 34.71,10.74 37.15,13.18 | 21.91,20.04 25.56,23.69 25.56,26.89 27.54,28.88 27.54,29.18 LEDS3:A1.1 | 37.15,13.18 37.15,16.68 30.29,23.54 30.29,25.52 30.59,25.83 30.59,26.13 LEDS3:A2.1 | LEDS2:R5.2 20.53,106.45 13.37,106.45 9.56,102.64 POWER1:3.3_STEPDOWN.3 9.56,102.48 9.56,96.54 11.09,95.02 11.09,93.95 LEDS2:R6.2 11.09,93.8 11.09,87.7 4.84,81.45 4.84,79.78 5.29,79.32 LEDS2:R7.2 5.29,79.17 5.29,68.5 2.7,65.91 2.7,64.38 3.47,63.62 LEDS2:R8.2 3.62,63.47 9.1,57.98 | LEDS2:A1.1 51.78,107.82 49.49,107.82 44.16,102.48 23.58,102.48 20.69,105.38 20.69,106.45 LEDS2:R5.2 | LEDS3:A0.1 24.65,32.23 26.48,34.06 27.24,34.06 LEDS3:U$1.1 27.39,34.21 27.39,39.7 35.01,47.32 | 34.1,51.58 34.1,48.38 35.01,47.47 | 34.1,51.58 34.1,52.5 MSP1:R1.2 34.1,52.65 34.1,53.87 35.16,54.94 35.32,54.94 44.61,45.64 47.51,45.64 | 20.53,56.16 20.53,52.5 MAGNETOMETER1:CY2.2 20.53,52.35 21.3,51.58 34.1,51.58 | 20.53,56.16 22.21,57.83 PRESSURESENSOR1:U$1.5 22.36,57.98 22.36,60.27 PRESSURESENSOR1:U$1.6 22.36,60.42 22.97,60.42 24.95,62.4
  Top 0.152: 25.41,61.95 25.41,62.1 MAGNETOMETER1:U$1.5 25.41,61.95 | 25.41,61.95 25.41,61.64 MAGNETOMETER1:U$1.6 25.56,61.64 26.17,61.64 26.63,61.18 | 26.63,61.18 26.93,61.18 MAGNETOMETER1:U$1.10 | 26.63,61.18 26.48,61.18 MAGNETOMETER1:U$1.9 | 24.95,62.4 24.95,64.84 19.31,70.48 19.31,72 PRESSURESENSOR1:CY1.1 | 25.41,61.95 24.95,62.4 | 9.1,57.98 11.54,60.42 PRESSURESENSOR1:R1.2 11.69,60.42 12.61,59.51 15.05,59.51 18.4,56.16 20.53,56.16 | 94.6,11.81 89.27,6.47 80.27,6.47 LEDS3:R7.2 | 94.6,11.81 94.6,12.57 LEDS3:R8.2 | 110.91,48.08 110.15,48.08 108.01,50.21 108.01,50.82 108.32,51.13 LEDS1:A2.1 | 110.91,48.08 121.73,48.08 LEDS1:R3.1 | 106.18,21.26 107.1,21.26 115.63,29.79 115.63,33.45 LEDS1:R2.1 | 106.18,21.26 105.88,21.26 LEDS1:R1.1 106.18,21.26 | 110.91,48.08 110.91,36.04 113.35,33.6 115.63,33.6 LEDS1:R2.1 | 94.6,11.81 100.7,11.81 103.59,8.91 104.35,8.91 106.18,10.74 106.18,21.26 | LEDS1:A0.1 103.29,56.46 105.88,59.05 LEDS1:U$1.1 106.03,59.2 106.94,59.2 107.55,59.81 108.47,59.81 v108.77,59.51 | 124.93,70.02 124.93,78.1 122.18,80.84 121.88,80.84 LEDS1:R5.2 121.73,81 121.73,89.99 116.39,95.32 115.78,95.32 LEDS1:R6.2 115.63,95.47 115.63,99.59 107.4,107.82 105.88,107.82 LEDS1:R7.2 105.73,107.82 104.51,107.82 95.06,117.27 93.38,117.27 LEDS1:R8.2 93.23,117.27 85.46,117.27 80.27,122.45 LEDS2:R1.1 80.12,122.6 80.12,122.91 78.29,124.74 64.73,124.74 LEDS2:R2.1 64.58,124.89 63.82,125.65 62.44,125.65 59.85,123.06 49.03,123.06 LEDS2:R3.1 48.88,123.06 48.27,123.06 47.81,123.52 46.9,123.52 40.19,116.81 | 124.93,70.02 124.93,64.69 124.17,63.93 124.17,63.62 LEDS1:R4.1 124.01,63.47 123.56,63.01
  Top 0.152: 123.56,63.01 123.4,62.86 115.63,62.86 115.33,62.56 115.33,62.1 112.58,59.36 112.43,59.36 111.36,60.42 106.03,60.42 102.07,56.46 102.07,55.85 104.05,53.87 105.88,53.87 LEDS1:A1.1 | 124.93,70.02 109.08,70.02 4_7SEGMENT1:LED_DRIVER_1.16 | 62.14,109.34 62.14,110.41 LEDS2:U$1.1 | 62.14,109.34 55.74,102.94 55.43,102.94 54.37,104.01 54.37,104.62 54.67,104.92 LEDS2:A2.1 54.82,105.08 54.82,105.84 55.89,106.9 55.89,107.67 55.59,107.97 55.59,108.43 56.5,109.34 56.5,109.95 52.69,113.76 51.78,113.76 48.88,110.87 LEDS2:A0.1 48.73,110.87 46.14,110.87 40.19,116.81 | 62.14,109.34 67.78,109.34 72.35,104.77 74.33,104.77 3_7SEGMENT1:U$1.16 | 40.19,116.81 39.89,117.12 34.4,117.12 LEDS2:R4.1 34.25,117.27 30.14,117.27 20.69,107.82 20.69,106.6 LEDS2:R5.2 | 123.56,63.01 123.56,40.31 116.85,33.6 115.78,33.6 LEDS1:R2.1
  Bottom 0.152: v108.77,59.51 108.77,69.72 108.93,69.87 4_7SEGMENT1:LED_DRIVER_1.16
3_7SEGMENT1:N$1  (via drill 0.35)
  Top 0.152: 3_7SEGMENT1:LED5.12 88.96,73.53 88.96,75.81 v74.33,90.45 82.26,98.37 v82.26,99.28
  Bottom 0.152: 3_7SEGMENT1:LED5.3 72.81,89.68 73.42,89.68 73.57,89.84 73.72,89.84 v74.33,90.45 74.33,92.12 68.54,97.91 68.39,97.91 67.63,98.67 67.63,99.44 63.51,103.55 63.51,104.62 3_7SEGMENT1:U$1.4 | v82.26,99.28 83.02,100.05 83.17,100.05 83.48,100.35 3_7SEGMENT1:LED5.26
3_7SEGMENT1:N$2
  Bottom 0.152: 77.68,86.18 78.14,86.18 83.17,81.15 83.17,80.08 83.48,79.78 83.48,78.86 3_7SEGMENT1:LED5.9 83.63,78.86 84.24,78.86 84.39,79.02 85.3,79.02 92.47,71.85 92.47,69.87 3_7SEGMENT1:LED5.14 | 77.68,86.18 77.23,86.18 77.07,86.03 76.46,86.03 3_7SEGMENT1:LED5.5 | 77.68,86.18 77.68,92.58 69.45,100.81 69.45,102.18 65.49,106.14 65.49,106.45 3_7SEGMENT1:U$1.3
3_7SEGMENT1:N$8
  Top 0.152: 3_7SEGMENT1:LED5.25 85.46,98.52 86.83,98.52 90.03,95.32 90.03,94.71 89.72,94.41 89.72,92.88 91.1,91.51 92.47,91.51 3_7SEGMENT1:LED5.21 92.62,91.36 92.62,89.53 99.63,82.52 101.46,82.52 3_7SEGMENT1:LED5.16
  Bottom 0.152: 3_7SEGMENT1:U$1.15 72.65,102.79 72.96,102.79 77.38,98.37 85.15,98.37 85.3,98.52 3_7SEGMENT1:LED5.25
3_7SEGMENT1:N$9
  Bottom 0.152: 94.14,88.01 101,81.15 102.07,81.15 102.37,81.45 102.83,81 102.98,81 103.29,80.69 3_7SEGMENT1:LED5.15 | 94.14,88.01 94.14,89.38 94.3,89.53 3_7SEGMENT1:LED5.20 | 94.14,88.01 87.59,94.56 87.59,95.63 87.29,95.93 87.29,96.69 3_7SEGMENT1:LED5.24 87.13,96.69 86.52,97.3 74.79,97.3 71.44,100.66 71.28,100.66 70.98,100.96 3_7SEGMENT1:U$1.14
3_7SEGMENT1:N$10
  Bottom 0.152: 3_7SEGMENT1:LED5.13 90.64,71.55 89.88,71.55 89.57,71.24 89.27,71.24 81.95,78.56 81.95,80.39 81.8,80.54 3_7SEGMENT1:LED5.8 81.65,80.69 81.49,80.84 80.73,80.84 80.58,81 79.51,81 74.18,86.33 74.18,86.64 74.48,86.94 74.48,87.7 3_7SEGMENT1:LED5.4 74.64,87.85 74.64,88.46 74.79,88.62 74.79,88.77 74.94,88.92 74.94,92.88 69.15,98.67 69.15,99.28 3_7SEGMENT1:U$1.13
3_7SEGMENT1:N$11
  Top 0.152: 3_7SEGMENT1:U$1.12 67.17,97.46 65.64,97.46 64.27,96.08 64.27,95.32 68.08,91.51 70.98,91.51 3_7SEGMENT1:LED5.2 71.13,91.36 71.13,89.84 78.45,82.52 79.97,82.52 3_7SEGMENT1:LED5.7 80.12,82.37 80.12,80.84 85.61,75.36 87.13,75.36 3_7SEGMENT1:LED5.11
3_7SEGMENT1:N$26
  Top 0.152: 3_7SEGMENT1:U$1.11 65.49,95.63 67.78,93.34 69.15,93.34 3_7SEGMENT1:LED5.1 69.3,93.19 70.67,93.19 78.14,85.72 78.14,84.35 3_7SEGMENT1:LED5.6 78.29,84.2 79.67,84.2 85.3,78.56 85.3,77.19 3_7SEGMENT1:LED5.10
3_7SEGMENT1:N$28
  Top 0.152: 3_7SEGMENT1:LED5.17 99.63,84.35 99.63,85.72 97.65,87.7 96.28,87.7 3_7SEGMENT1:LED5.19 96.12,87.85 96.12,89.68 82.56,103.25 81.49,103.25 79.97,101.72 72.2,101.72 71.13,102.79 61.99,102.79 3_7SEGMENT1:U$1.5
3_7SEGMENT1:N$29
  Top 0.152: 81.8,100.81 81.8,102.18 3_7SEGMENT1:LED5.27 | 81.8,100.81 87.59,95.02 88.96,95.02 3_7SEGMENT1:LED5.23 | 81.8,100.81 81.04,100.05 70.37,100.05 69.91,100.5 68.69,100.5 67.63,99.44 58.33,99.44 3_7SEGMENT1:U$1.7
3_7SEGMENT1:N$30
  Top 0.152: 3_7SEGMENT1:LED5.18 97.8,86.03 96.58,86.03 93.38,89.23 93.38,90.9 93.53,91.05 93.53,91.82 92.16,93.19 90.79,93.19 3_7SEGMENT1:LED5.22 | 3_7SEGMENT1:LED5.28 79.97,103.86 75.09,103.86 74.79,103.55 73.57,103.55 73.11,104.01 64.43,104.01 63.97,103.55 62.75,103.55 62.29,104.01 61.38,104.01 60.16,102.79 60.16,101.11 3_7SEGMENT1:U$1.6
  Bottom 0.152: 3_7SEGMENT1:LED5.22 90.64,93.34 90.64,94.1 90.33,94.41 90.33,95.47 82.26,103.55 81.19,103.55 80.88,103.86 80.12,103.86 3_7SEGMENT1:LED5.28
4_7SEGMENT1:N$1
  Top 0.152: 4_7SEGMENT1:LD3.1 69.76,67.59 68.39,67.59 55.89,80.08 55.89,81.3 4_7SEGMENT1:LD2.1 55.74,81.45 54.52,81.45 41.87,94.1 41.87,95.32 4_7SEGMENT1:LD1.1
  Bottom 0.152: 4_7SEGMENT1:LD3.1 69.91,67.43 69.91,67.13 70.37,66.67 70.37,65.15 80.12,55.39 81.19,55.39 83.02,53.56 83.78,53.56 4_7SEGMENT1:LD4.1 83.93,53.56 84.69,53.56 98.87,67.74 106.03,67.74 106.34,68.04 107.1,68.04 4_7SEGMENT1:LED_DRIVER_1.15
4_7SEGMENT1:N$2  (via drill 0.35)
  Top 0.152: 4_7SEGMENT1:LD3.14 76.92,53.11 76.92,58.14 68.08,66.98 63.05,66.98 4_7SEGMENT1:LD2.14 62.9,67.13 62.9,68.5 50.4,81 49.03,81 4_7SEGMENT1:LD1.14 | v77.68,51.13 89.72,39.09 90.94,39.09 4_7SEGMENT1:LD4.14
  Bottom 0.152: v77.68,51.13 77.68,52.19 76.92,52.95 4_7SEGMENT1:LD3.14 | 4_7SEGMENT1:LED_DRIVER_1.14 105.42,66.21 105.42,65.6 104.96,65.15 104.96,56.76 91.55,43.35 91.55,39.85 91.1,39.39 91.1,39.09 4_7SEGMENT1:LD4.14
4_7SEGMENT1:N$3
  Top 0.152: 4_7SEGMENT1:LD2.12 59.4,63.62 59.4,64.84 46.75,77.49 45.53,77.49 4_7SEGMENT1:LD1.12
  Bottom 0.152: 82.1,41.07 78.14,45.03 76.16,45.03 74.18,47.01 74.18,48.54 73.57,49.14 73.57,49.45 4_7SEGMENT1:LD3.12 73.57,49.6 64.58,58.59 64.58,60.12 63.21,61.49 61.68,61.49 60.01,63.17 59.85,63.17 59.55,63.47 4_7SEGMENT1:LD2.12 | 82.1,41.07 87.13,36.04 87.13,35.89 87.44,35.58 4_7SEGMENT1:LD4.12 | 82.1,41.07 103.29,62.25 103.29,63.01 103.13,63.17 103.13,63.32 103.59,63.78 103.59,64.54 4_7SEGMENT1:LED_DRIVER_1.13
4_7SEGMENT1:N$4
  Top 0.152: 4_7SEGMENT1:LD1.10 41.87,73.83 43.24,73.83 55.74,61.34 55.74,59.97 4_7SEGMENT1:LD2.10 55.89,59.81 57.26,59.81 69.76,47.32 69.76,45.94 4_7SEGMENT1:LD3.10 69.91,45.79 69.91,44.42 82.41,31.92 83.78,31.92 4_7SEGMENT1:LD4.10 83.93,31.92 84.08,32.08 85.3,32.08 92.01,38.78 92.01,39.24 92.31,39.54 92.77,39.54 95.51,42.29 95.51,43.05 95.36,43.2 95.36,57.83 97.5,59.97 97.5,68.65 97.04,69.11 97.04,70.33 97.8,71.09 98.56,71.09 99.32,70.33 99.32,70.02 101.76,67.59 101.76,62.86 4_7SEGMENT1:LED_DRIVER_1.12
4_7SEGMENT1:N$5
  Top 0.152: 46.29,80.23 46.29,78.86 49.03,76.12 50.4,76.12 4_7SEGMENT1:LD2.4 | 46.29,80.23 46.29,85.11 38.52,92.88 37.91,92.88 36.54,91.51 36.54,90.14 4_7SEGMENT1:LD1.4 | 46.29,80.23 48.12,80.23 63.51,64.84 66.56,64.84 67.17,64.23 67.17,63.47 65.8,62.1 64.58,62.1 4_7SEGMENT1:LD3.4
  Bottom 0.152: 77.23,48.54 76.16,48.54 64.88,59.81 64.88,60.88 64.58,61.18 64.58,61.95 4_7SEGMENT1:LD3.4 | 77.23,48.54 77.53,48.54 77.99,48.08 78.45,48.08 4_7SEGMENT1:LD4.4 | 77.23,48.54 79.82,51.13 80.73,51.13 81.49,50.36 82.56,50.36 92.77,60.57 98.87,60.57 99.17,60.88 99.93,60.88 4_7SEGMENT1:LED_DRIVER_1.11
4_7SEGMENT1:N$6  (via drill 0.35)
  Top 0.152: 36.08,88.31 34.71,88.31 4_7SEGMENT1:LD1.5 | 36.08,88.31 38.21,90.45 38.21,91.82 4_7SEGMENT1:LD1.3 | 36.08,88.31 43.55,80.84 43.55,75.81 4_7SEGMENT1:LD1.11 43.7,75.66 43.7,73.83 71.13,46.4 72.35,46.4 75.55,49.6 | 75.55,49.6 75.25,49.91 75.25,51.13 4_7SEGMENT1:LD3.13 | 75.55,49.6 87.74,37.41 89.11,37.41 4_7SEGMENT1:LD4.13 | v92.62,38.93 95.82,42.13 95.82,51.58 99.32,55.09 99.32,59.66 98.26,60.73 98.26,69.87 4_7SEGMENT1:LED_DRIVER_1.4
  Bottom 0.152: 4_7SEGMENT1:LD1.16 52.54,84.65 52.54,84.35 51.93,83.74 52.08,83.59 52.08,82.37 45.98,76.27 44.46,76.27 44,75.81 43.7,75.81 4_7SEGMENT1:LD1.11 | v92.62,38.93 91.1,37.41 89.27,37.41 4_7SEGMENT1:LD4.13
4_7SEGMENT1:N$7  (via drill 0.35)
  Top 0.152: 4_7SEGMENT1:LD1.9 40.04,72 40.04,70.79 52.69,58.14 53.91,58.14 4_7SEGMENT1:LD2.9 54.06,57.98 54.06,56.76 66.71,44.12 67.93,44.12 4_7SEGMENT1:LD3.9 68.08,43.96 68.08,42.74 80.73,30.09 81.95,30.09 4_7SEGMENT1:LD4.9 | v86.52,32.38 86.98,32.38 96.12,41.52 96.12,51.43 102.98,58.29 102.98,63.17 102.53,63.62 102.53,67.28 100.09,69.72 100.09,71.7 4_7SEGMENT1:LED_DRIVER_1.3
  Bottom 0.152: v86.52,32.38 84.39,30.25 82.26,30.25 82.1,30.09 4_7SEGMENT1:LD4.9
4_7SEGMENT1:N$9
  Top 0.152: 4_7SEGMENT1:LD1.2 40.04,93.65 41.41,93.65 53.91,81.15 53.91,79.78 4_7SEGMENT1:LD2.2 54.06,79.62 55.89,79.62 69,66.52 93.23,66.52 94.14,67.43 95.06,67.43 95.67,66.82 95.67,65.91 94.45,64.69 92.92,64.69 4_7SEGMENT1:LED_DRIVER_1.7 92.77,64.54 92.77,61.03 80.88,49.14 | 4_7SEGMENT1:LD4.11 85.61,33.75 85.61,37.26 76.77,46.1 4_7SEGMENT1:LD4.5 | 80.88,49.14 80.27,49.75 4_7SEGMENT1:LD4.3 | 80.88,49.14 87.29,42.74 94.6,42.74 4_7SEGMENT1:LD4.16
  Bottom 0.152: 4_7SEGMENT1:LD4.3 80.12,49.75 80.12,47.93 78.9,46.71 77.84,46.71 77.53,46.4 77.38,46.4 77.23,46.25 76.77,46.25 4_7SEGMENT1:LD4.5
4_7SEGMENT1:N$12
  Top 0.152: 4_7SEGMENT1:LED_DRIVER_1.5 96.28,68.19 70.37,68.19 67.93,70.63 66.71,70.63 4_7SEGMENT1:LD2.16 | 4_7SEGMENT1:LD2.5 48.73,74.14 57.57,65.3 57.57,61.79 4_7SEGMENT1:LD2.11 57.72,61.64 57.72,60.27 71.28,46.71 72.05,46.71 74.33,48.99 74.33,51.74 74.79,52.19 75.7,52.19 76.16,51.74 81.95,51.74 4_7SEGMENT1:LD4.2 | 4_7SEGMENT1:LD3.2 67.93,65.76 63.05,65.76 52.39,76.42 52.39,77.8 4_7SEGMENT1:LD2.3
  Bottom 0.152: 4_7SEGMENT1:LD2.16 66.71,70.63 66.71,69.87 67.63,68.96 67.63,66.82 67.93,66.52 67.93,65.76 4_7SEGMENT1:LD3.2 | 4_7SEGMENT1:LD2.3 52.39,77.8 52.39,76.27 50.71,74.6 49.79,74.6 49.64,74.44 48.88,74.44 48.73,74.29 4_7SEGMENT1:LD2.5
4_7SEGMENT1:N$13
  Top 0.152: 62.6,63.78 62.6,60.27 4_7SEGMENT1:LD3.5 62.75,60.12 72.5,50.36 | 62.6,63.78 61.22,65.15 4_7SEGMENT1:LD2.13 61.07,65.3 61.07,66.82 48.73,79.17 47.36,79.17 4_7SEGMENT1:LD1.13 | 62.6,63.78 66.1,63.78 4_7SEGMENT1:LD3.3 | 72.5,50.36 74.64,52.5 76.31,52.5 76.77,52.04 77.38,52.04 80.58,55.24 80.58,56.61 4_7SEGMENT1:LD3.16 80.73,56.76 90.18,66.21 94.6,66.21 4_7SEGMENT1:LED_DRIVER_1.6 | 72.5,50.36 71.74,49.6 71.74,47.77 4_7SEGMENT1:LD3.11
GND  (via drill 0.35)  (21 unrouted)
  Top 0.152: MAGNETOMETER1:U$1.3 26.02,62.71 26.33,62.71 MAGNETOMETER1:U$1.2 26.48,62.56 26.48,62.25 26.63,62.1 26.93,62.1 MAGNETOMETER1:U$1.12 27.09,62.1 27.7,62.1 | 27.7,62.1 30.44,62.1 31.05,61.49 32.27,61.49 | 32.27,61.49 32.42,61.64 32.42,63.32 31.81,63.93 MAGNETOMETER1:CY1.1 31.66,64.08 23.73,72 20.99,72 PRESSURESENSOR1:CY1.2 | 27.7,62.1 27.7,60.57 22.21,55.09 22.21,52.5 MAGNETOMETER1:CY2.1 | POWER1:C4.2 34.4,21.87 34.4,22.63 v33.18,23.85 31.96,25.07 LEDS3:A2.3 31.96,25.22 33.49,26.74 33.49,27.81 LEDS3:U$1.8 33.64,27.96 33.64,29.03 31.96,30.7 29.37,28.11 28.76,28.11 LEDS3:A1.3 | POWER1:R3.1 64.12,30.4 64.12,28.11 66.86,25.37 66.86,24.76 66.56,24.46 POWER1:U1.2 66.41,24.3 66.25,24.15 65.64,24.15 62.9,26.89 59.55,26.89 59.4,26.74 58.79,26.74 POWER1:C1.1 46.75,26.74 45.53,27.96 MSP1:S1.P$1 | POWER1:C2.1 68.84,15.46 v71.59,18.21 74.33,20.95 74.33,21.26 73.26,22.32 72.2,22.32 POWER1:R2.2 | LEDS1:A2.3 109.69,50.06 v111.06,51.43 112.28,52.65 LEDS1:U$1.8 112.28,52.8 112.28,54.02 110.75,55.55 110.6,55.55 107.86,52.8 107.1,52.8 LEDS1:A1.3 | MSP1:R3.1 36.99,40.61 v35.77,40.61 34.55,40.61 32.42,38.48 31.66,38.48 31.35,38.17 LEDS3:U$1.16 | LEDS2:U$1.16 58.18,106.45 v56.96,105.23 55.74,104.01 LEDS2:A2.3 | v21.3,31.31 20.53,30.55 POWER1:C3.2 | v109.38,63.62 109.84,63.17 LEDS1:U$1.16 | v55.28,117.42 55.89,116.81 LEDS2:U$1.8 | v26.63,31.92 25.87,31.16 LEDS3:A0.3 | v105.27,56.16 104.51,55.39 LEDS1:A0.3 | v49.19,108.89 49.95,109.65 LEDS2:A0.3 | v52.08,105.84 52.84,106.6 LEDS2:A1.3 | 32.27,61.49 32.27,60.88 40.35,52.8
  pour Bottom: 40.31,130.67 0.79,130.67 -4.6,125.28 -4.6,4.95 6.18,-5.83 121.13,-5.83 134.6,7.64 134.6,122.59 125.62,131.57 41.2,131.57
LEDS1:N$1  (via drill 0.35)
  Top 0.152: v105.88,55.39 107.71,57.22 LEDS1:U$1.3 | v103.44,52.95 103.44,26.74 102.07,25.37 102.07,24.46 103.29,23.24 105.12,23.24 LEDS1:D1.K
  Bottom 0.152: v103.44,52.95 v105.88,55.39
LEDS1:N$2
  Top 0.152: LEDS1:U$1.4 108.62,56.31 107.71,56.31 106.18,54.78 104.81,54.78 104.35,54.33 104.05,54.33 102.37,56 102.37,56.31 106.18,60.12 111.21,60.12 113.65,57.68 114.56,57.68 115.48,58.59 115.63,58.59 123.25,50.97 123.25,40.46 116.85,34.06 116.39,34.06 116.09,34.36 115.94,34.36 115.78,34.51 115.63,34.51 115.02,35.12 114.56,35.12 LEDS1:D2.K
LEDS1:N$3
  Top 0.152: LEDS1:U$1.5 109.69,55.55 110.15,55.55 110.45,55.85 110.91,55.85 116.39,50.36 116.39,49.6 117.31,48.69 119.59,48.69 120.2,49.3 LEDS1:D3.K
LEDS1:N$4
  Top 0.152: LEDS1:U$1.6 110.45,54.48 109.99,54.48 107.25,51.74 105.73,51.74 101.76,55.7 101.76,56.61 106.34,61.18 110.91,61.18 111.97,62.25 112.28,62.25 113.19,63.17 120.97,63.17 122.18,64.38 LEDS1:D4.K
LEDS1:N$5  (via drill 0.35)
  Top 0.152: v116.85,62.25 114.56,59.97 114.56,58.59 LEDS1:U$1.11
  Bottom 0.152: v116.85,62.25 116.85,75.36 120.2,78.71 120.2,79.47 LEDS1:D5.K
LEDS1:N$6  (via drill 0.35)
  Top 0.152: v115.94,62.25 113.65,59.97 113.65,59.51 LEDS1:U$1.12
  Bottom 0.152: v115.94,62.25 115.94,91.36 114.56,92.73 114.56,93.65 LEDS1:D6.K
LEDS1:N$7  (via drill 0.35)
  Top 0.152: v113.65,62.56 113.65,61.79 112.74,60.88 112.74,60.42 LEDS1:U$1.13 | v113.65,70.63 113.65,89.07 108.16,94.56 108.16,106.6 107.25,107.51 106.94,107.51 105.27,105.84 LEDS1:D7.K
  Bottom 0.152: v113.65,70.63 v113.65,62.56
LEDS1:N$8  (via drill 0.35)
  Top 0.152: v112.89,61.95 112.28,61.34 111.82,61.34 LEDS1:U$1.14 | v111.97,62.86 111.97,65.45 104.96,72.46 104.96,97.76 90.49,112.24 90.49,113.46 92.01,114.98 92.92,114.98 LEDS1:D8.K
  Bottom 0.152: v111.97,62.86 v112.89,61.95
LEDS1:N$9
  Top 0.152: LEDS1:U$1.7 111.36,53.56 111.36,52.95 109.08,50.67 LEDS1:A2.2
LEDS1:N$10
  Top 0.152: LEDS1:U$1.10 115.33,57.53 114.87,57.53 114.72,57.37 110.75,57.37 106.49,53.11 LEDS1:A1.2
LEDS1:N$11  (via drill 0.35)
  Top 0.152: v111.06,56.76 116.24,56.76 LEDS1:U$1.9 | v110.15,57.68 108.62,57.68 108.01,58.29 107.86,58.29 106.34,56.76 104.81,56.76 103.9,55.85 LEDS1:A0.2
  Bottom 0.152: v110.15,57.68 v111.06,56.76
LEDS1:N$12
  Top 0.152: LEDS1:R5.1 122.18,79.17 121.73,79.17 120.81,78.25 118.53,78.25 117.92,78.86 LEDS1:D5.A
LEDS1:N$13
  Top 0.152: LEDS1:R6.1 116.39,93.8 115.02,92.43 112.28,92.43 LEDS1:D6.A
LEDS1:N$14
  Top 0.152: LEDS1:R7.1 106.94,106.45 106.94,105.84 105.12,104.01 103.44,104.01 LEDS1:D7.A
LEDS1:N$15
  Top 0.152: LEDS1:R8.1 94.6,116.2 94.6,114.83 92.77,113 91.86,113 LEDS1:D8.A
LEDS1:N$16
  Top 0.152: LEDS1:R1.2 106.94,22.47 106.94,23.08 105.12,24.91 103.44,24.91 LEDS1:D1.A
LEDS1:N$18
  Top 0.152: LEDS1:R2.2 116.39,35.12 114.87,36.65 112.28,36.65 LEDS1:D2.A
LEDS1:N$19
  Top 0.152: LEDS1:R3.2 122.18,49.75 121.73,49.75 120.81,50.67 118.53,50.67 117.92,50.06 LEDS1:D3.A
LEDS1:N$20
  Top 0.152: LEDS1:R4.2 124.01,65.45 122.95,65.45 122.64,65.76 120.97,65.76 119.75,64.54 LEDS1:D4.A
LEDS2:N$1
  Top 0.152: LEDS2:U$1.3 60.46,112.39 61.07,112.39 65.8,117.12 78.75,117.12 79.67,118.03 79.67,120.16 79.06,120.77 LEDS2:D1.K
LEDS2:N$2
  Top 0.152: LEDS2:U$1.4 59.55,113.15 59.55,114.37 65.03,119.86 65.03,121.69 63.97,122.75 LEDS2:D2.K
LEDS2:N$3
  Top 0.152: LEDS2:U$1.5 58.63,114.07 58.63,115.74 53.6,120.77 48.73,120.77 LEDS2:D3.K
LEDS2:N$4  (via drill 0.35)
  Top 0.152: v41.11,116.81 42.17,115.74 55.74,115.74 56.81,116.81 57.11,116.81 57.72,116.2 57.72,114.98 LEDS2:U$1.6
  Bottom 0.152: v41.11,116.81 40.35,116.05 35.77,116.05 34.71,114.98 LEDS2:D4.K
LEDS2:N$5
  Top 0.152: LEDS2:U$1.11 53.76,111.02 53.76,112.24 53.15,112.85 53,112.85 51.01,110.87 51.01,109.8 44,102.79 23.73,102.79 22.52,104.01 22.52,105.69 LEDS2:D5.K
LEDS2:N$6
  Top 0.152: LEDS2:U$1.12 54.52,109.95 54.52,108.28 53.91,107.67 53.91,106.75 46.44,99.28 24.19,99.28 15.96,91.05 14.9,91.05 13.37,92.58 13.37,93.65 LEDS2:D6.K
LEDS2:N$7
  Top 0.152: LEDS2:U$1.13 55.43,109.04 55.43,108.73 54.21,107.51 54.21,106.6 46.59,98.98 34.25,98.98 12.91,77.64 9.26,77.64 7.43,79.47 LEDS2:D7.K
LEDS2:N$8  (via drill 0.35)
  Top 0.152: v57.26,109.19 56.5,108.43 LEDS2:U$1.14 | v55.28,107.21 46.75,98.67 42.33,98.67 9.26,65.6 9.26,64.08 8.34,63.17 6.67,63.17 5.45,64.38 LEDS2:D8.K
  Bottom 0.152: v55.28,107.21 v57.26,109.19
LEDS2:N$9
  Top 0.152: LEDS2:U$1.7 56.81,115.74 56.81,110.56 57.87,109.5 57.87,108.73 56.2,107.06 56.2,105.23 55.43,104.47 LEDS2:A2.2
LEDS2:N$10
  Top 0.152: LEDS2:U$1.10 52.84,111.78 52.84,107.67 52.54,107.36 LEDS2:A1.2
LEDS2:N$11
  Top 0.152: LEDS2:U$1.9 51.93,112.7 49.49,110.26 LEDS2:A0.2
LEDS2:N$12
  Top 0.152: LEDS2:R5.1 21.91,107.67 22.36,107.67 24.19,105.84 24.19,104.01 LEDS2:D5.A
LEDS2:N$13
  Top 0.152: LEDS2:R6.1 12.15,95.32 13.37,95.32 15.35,93.34 15.35,92.43 LEDS2:D6.A
LEDS2:N$14
  Top 0.152: LEDS2:R7.1 5.9,81 7.88,81 9.87,79.02 LEDS2:D7.A
LEDS2:N$15
  Top 0.152: LEDS2:R8.1 3.62,65.45 4.68,65.45 4.99,65.76 6.67,65.76 7.88,64.54 LEDS2:D8.A
LEDS2:N$16
  Top 0.152: LEDS2:R1.2 78.6,122.91 78.6,122.45 77.68,121.53 77.68,118.94 78.14,118.49 LEDS2:D1.A
LEDS2:N$18
  Top 0.152: LEDS2:R2.2 62.9,124.74 62.9,123.67 62.6,123.36 62.6,121.69 63.82,120.47 LEDS2:D2.A
LEDS2:N$19
  Top 0.152: LEDS2:R3.2 47.36,122.45 47.36,120.47 49.34,118.49 LEDS2:D3.A
LEDS2:N$20
  Top 0.152: LEDS2:R4.2 33.03,116.2 33.03,114.83 34.86,113 35.77,113 LEDS2:D4.A
LEDS3:N$1
  Top 0.152: LEDS3:U$1.3 28.92,32.38 28,32.38 25.72,30.09 25.41,30.09 11.24,44.27 11.24,50.52 10.48,51.28 9.26,51.28 7.43,49.45 LEDS3:D1.K
LEDS3:N$2
  Top 0.152: LEDS3:U$1.4 29.83,31.47 27.54,31.47 25.87,29.79 24.04,29.79 15.96,37.87 14.9,37.87 13.37,36.34 13.37,35.28 LEDS3:D2.K
LEDS3:N$3
  Top 0.152: LEDS3:U$1.5 30.74,30.55 28.15,30.55 22.52,24.91 22.52,23.24 LEDS3:D3.K
LEDS3:N$4
  Top 0.152: LEDS3:U$1.6 31.66,29.64 31.66,27.96 29.83,26.13 29.83,18.66 34.55,13.94 LEDS3:D4.K
LEDS3:N$5  (via drill 0.35)
  Top 0.152: v33.49,31.47 35.62,33.6 LEDS3:U$1.11
  Bottom 0.152: v33.49,31.47 33.49,26.59 47.81,12.26 47.81,9.37 48.58,8.61 48.58,8.15 LEDS3:D5.K
LEDS3:N$6
  Top 0.152: LEDS3:U$1.12 34.86,34.67 35.93,34.67 37.6,32.99 37.6,32.84 36.54,31.77 36.54,29.79 39.74,26.59 39.74,20.04 38.67,18.97 38.67,13.79 49.19,3.27 63.51,3.27 63.82,3.58 63.82,6.02 LEDS3:D6.K
LEDS3:N$7  (via drill 0.35)
  Top 0.152: v36.08,35.28 35.77,35.58 33.95,35.58 LEDS3:U$1.13 | v38.52,32.84 43.85,32.84 44.16,32.53 44.46,32.53 46.29,34.36 46.29,34.82 48.42,36.95 55.59,36.95 56.65,38.02 65.19,38.02 79.67,23.54 79.67,8.76 79.06,8.15 LEDS3:D7.K
  Bottom 0.152: v38.52,32.84 v36.08,35.28
LEDS3:N$8  (via drill 0.35)
  Top 0.152: v35.16,37.11 34.25,37.11 33.64,36.5 33.03,36.5 LEDS3:U$1.14
  Bottom 0.152: v35.16,37.11 42.48,29.79 49.95,29.79 65.34,14.4 91.7,14.4 92.16,13.94 92.92,13.94 LEDS3:D8.K
LEDS3:N$9
  Top 0.152: LEDS3:U$1.7 32.57,28.72 32.57,27.05 31.35,25.83 LEDS3:A2.2
LEDS3:N$10  (via drill 0.35)
  Top 0.152: v31.66,31.47 32.27,30.86 33.79,30.86 35.62,32.69 36.54,32.69 LEDS3:U$1.10 | v29.98,29.79 29.37,29.79 28.31,28.72 LEDS3:A1.2
  Bottom 0.152: v29.98,29.79 v31.66,31.47
LEDS3:N$11
  Top 0.152: LEDS3:U$1.9 37.6,31.92 37.6,32.38 37.91,32.69 37.91,37.11 36.84,38.17 32.12,38.17 26.48,32.53 26.17,32.53 25.26,31.62 LEDS3:A0.2
LEDS3:N$12
  Top 0.152: LEDS3:R5.1 47.36,6.47 47.36,8.61 49.34,10.59 LEDS3:D5.A
LEDS3:N$13
  Top 0.152: LEDS3:R6.1 62.9,4.19 62.9,5.25 62.6,5.56 62.6,7.23 63.82,8.45 LEDS3:D6.A
LEDS3:N$14
  Top 0.152: LEDS3:R7.1 78.6,6.02 78.6,6.47 77.68,7.39 77.68,9.98 78.14,10.44 LEDS3:D7.A
LEDS3:N$15
  Top 0.152: LEDS3:R8.1 93.23,11.81 91.7,13.33 91.7,16.07 LEDS3:D8.A
LEDS3:N$16
  Top 0.152: LEDS3:R1.2 5.9,48.08 8.04,48.08 9.87,49.91 LEDS3:D1.A
LEDS3:N$18
  Top 0.152: LEDS3:R2.2 12.15,33.6 13.37,33.6 15.35,35.58 15.35,36.5 LEDS3:D2.A
LEDS3:N$19
  Top 0.152: LEDS3:R3.2 21.91,21.26 22.36,21.26 24.19,23.08 24.19,24.91 LEDS3:D3.A
LEDS3:N$20
  Top 0.152: LEDS3:R4.2 35.93,13.33 35.93,16.07 LEDS3:D4.A
MAGNETOMETER1:N$3
  Top 0.152: MAGNETOMETER1:U$1.4 25.41,62.71 25.41,64.08 25.72,64.38 29.68,64.38 31.66,62.4 MAGNETOMETER1:CY1.2
MSP1:N$1  (2 unrouted)
  Top 0.152: 36.84,45.64 36.84,47.93 35.32,49.45 35.32,53.72 MSP1:R1.1 | 36.84,45.49 32.88,41.52 32.88,40.76 MSP1:S1.P$2
MSP1:N$2  (1 unrouted)
  Top 0.152: 38.67,43.81 38.36,43.51 38.36,39.54 MSP1:R3.2 38.36,39.39 44.16,33.6 MSP1:R2.1
N$1  (via drill 0.35)
  Top 0.152: v39.13,26.28 35.77,22.93 POWER1:C4.1 | v40.04,27.2 40.35,27.2 45.38,32.23 MSP1:R2.2 45.53,32.38 46.59,32.38 48.73,34.51 55.89,34.51 59.09,37.71 59.7,37.71 69.15,28.27 v74.03,28.27 | v8.04,57.98 7.73,57.98 2.4,63.32 2.4,79.47 5.75,82.83 5.75,106.14 POWER1:3.3_STEPDOWN.1 | v74.94,29.18 82.41,29.18 85,31.77 99.48,31.77 POWER1:D1.C
  Bottom 0.152: POWER1:PMOS.3 108.01,6.93 108.01,8.61 108.16,8.76 108.16,22.93 99.63,31.47 99.63,31.77 POWER1:D1.C | v40.04,27.2 39.43,26.59 | 39.43,26.59 v39.13,26.28 | 39.43,26.59 v8.04,57.98 | v74.03,28.27 v74.94,29.18
N$2  (1 unrouted)
  Top 0.152: POWER1:U1.1 67.17,23.69 66.56,23.69 66.41,23.54 65.03,23.54 61.99,26.59 59.7,26.59 57.57,24.46 46.44,24.46 43.85,21.87 POWER1:LD1.CR 41.41,21.71 40.19,20.49 40.19,18.21 POWER1:LD1.CX
POWER1:N$2  (via drill 0.35)
  Top 0.152: 68.69,14.4 69,14.4 74.64,20.04 74.64,21.41 63.36,32.69 62.75,32.69 | 68.69,14.4 68.54,14.4 67.63,15.31 67.63,16.53 POWER1:C2.2 | 62.75,32.69 61.83,31.77 61.83,29.18 65.8,25.22 POWER1:U1.3 | 68.69,14.4 77.99,5.1 88.35,5.1 91.86,8.61 106.18,8.61 POWER1:PMOS.2 | v59.4,37.11 59.4,36.04 62.75,32.69
  Bottom 0.152: v59.4,37.11 59.4,44.12 20.84,82.67 20.84,83.59 POWER1:LIPO.1
POWER1:N$4  (via drill 0.35)
  Top 0.152: POWER1:R1.1 53.15,22.32 56.5,22.32 59.7,25.52 POWER1:C1.2 61.83,25.52 63.97,23.39 POWER1:U1.4 64.12,23.24 64.58,22.78 67.02,22.78 68.08,23.85 | 68.08,23.85 68.08,27.5 63.97,31.62 62.9,31.62 POWER1:R3.2 | POWER1:PMOS.1 104.35,10.59 104.35,16.38 94.3,26.44 POWER1:D1.A 94.14,26.44 87.74,20.04 84.54,20.04 POWER1:QIRECEIVER.1 | 68.08,23.85 71.28,23.85 v71.59,23.54
  Bottom 0.152: v71.59,23.54 78.6,23.54 82.1,20.04 84.39,20.04 POWER1:QIRECEIVER.1
POWER1:N$6
  Top 0.152: POWER1:R2.1 73.26,21.26 66.1,21.26 65.49,21.87 POWER1:U1.5
POWER1:N$7
  Top 0.152: POWER1:R1.2 51.78,23.39 47.66,23.39 44.31,20.04 42.02,20.04 POWER1:LD1.A
PRESSURESENSOR1:N$1
  Top 0.152: PRESSURESENSOR1:R1.1 11.69,62.1 12.91,62.1 14.59,60.42 PRESSURESENSOR1:U$1.3
SCL  (via drill 0.35)  (2 unrouted)
  Top 0.152: v26.02,63.78 26.93,62.86 26.93,62.71 MAGNETOMETER1:U$1.1 | v36.08,37.11 35.47,37.71 34.86,37.71 34.55,37.41 32.27,37.41 LEDS3:U$1.15 | 24.34,72.77 18.55,72.77 14.74,68.96 14.74,65.6 PRESSURESENSOR1:U$1.1 | 24.34,72.77 51.17,45.94 51.17,42.13 | LEDS2:U$1.15 57.41,107.51 59.4,107.51 v61.38,109.5 61.38,110.1 60.31,111.17 61.38,112.24 74.48,112.24 104.66,82.06 104.66,74.9 103.44,73.68 101.92,73.68 4_7SEGMENT1:LED_DRIVER_1.2 101.92,73.53 101.92,71.85 106.79,66.98 107.25,66.98 110.91,63.32 110.91,62.25 LEDS1:U$1.15 | 24.34,72.77 24.34,79.78 42.63,98.07 55.43,98.07 58.18,100.81 v58.63,100.81
  Bottom 0.152: v26.02,63.78 25.56,64.23 17.03,64.23 15.81,65.45 14.74,65.45 PRESSURESENSOR1:U$1.1 | v36.08,37.11 36.99,36.19 43.7,36.19 48.27,40.76 49.79,40.76 51.17,42.13 | 3_7SEGMENT1:U$1.2 67.17,108.43 66.71,108.43 65.64,109.5 v61.38,109.5 58.63,106.75 v58.63,100.81
SDA  (via drill 0.35)  (1 unrouted)
  Top 0.152: v24.65,61.03 25.11,60.57 27.24,60.57 27.39,60.73 27.39,61.49 27.24,61.64 27.09,61.64 MAGNETOMETER1:U$1.11 | v37.3,36.8 36.99,36.5 34.1,36.5 31.05,33.45 28.31,33.45 LEDS3:U$1.2 | LEDS2:U$1.2 61.38,111.32 67.78,111.32 69,110.1 3_7SEGMENT1:U$1.1 69.15,109.95 76.31,109.95 102.53,83.74 102.53,81.3 102.37,81.15 102.37,76.58 103.59,75.36 4_7SEGMENT1:LED_DRIVER_1.1 | v107.86,59.2 106.94,58.29 LEDS1:U$1.2 | v68.54,107.67 68.08,107.21 66.71,107.21 66.25,107.67 64.58,107.67 55.28,98.37 42.48,98.37 13.07,68.96 13.07,65.15 13.68,64.54 15.05,64.54 16.57,63.01 22.21,63.01 PRESSURESENSOR1:U$1.7
  Bottom 0.152: PRESSURESENSOR1:U$1.7 22.36,62.86 22.82,62.86 v24.65,61.03 44.77,40.92 | v37.3,36.8 40.65,36.8 44.77,40.92 | 44.77,40.92 46.75,42.9 47.81,42.9 48.12,43.2 48.73,43.2 49.34,43.81 | v107.86,59.2 107.86,66.82 108.47,67.43 108.47,68.8 107.86,69.41 107.71,69.41 104.51,72.61 104.51,74.29 103.59,75.21 4_7SEGMENT1:LED_DRIVER_1.1 | v68.54,107.67 69.15,108.28 69.15,109.95 3_7SEGMENT1:U$1.1

### Text on the board
tPlace: Dan Sturm & Robert Barlow | Coral Sensor Rev 1.1